# EAGLE design Power Switching Circuit rev3 (EAGLE 9.6.2)

## Sheet 1 of 2
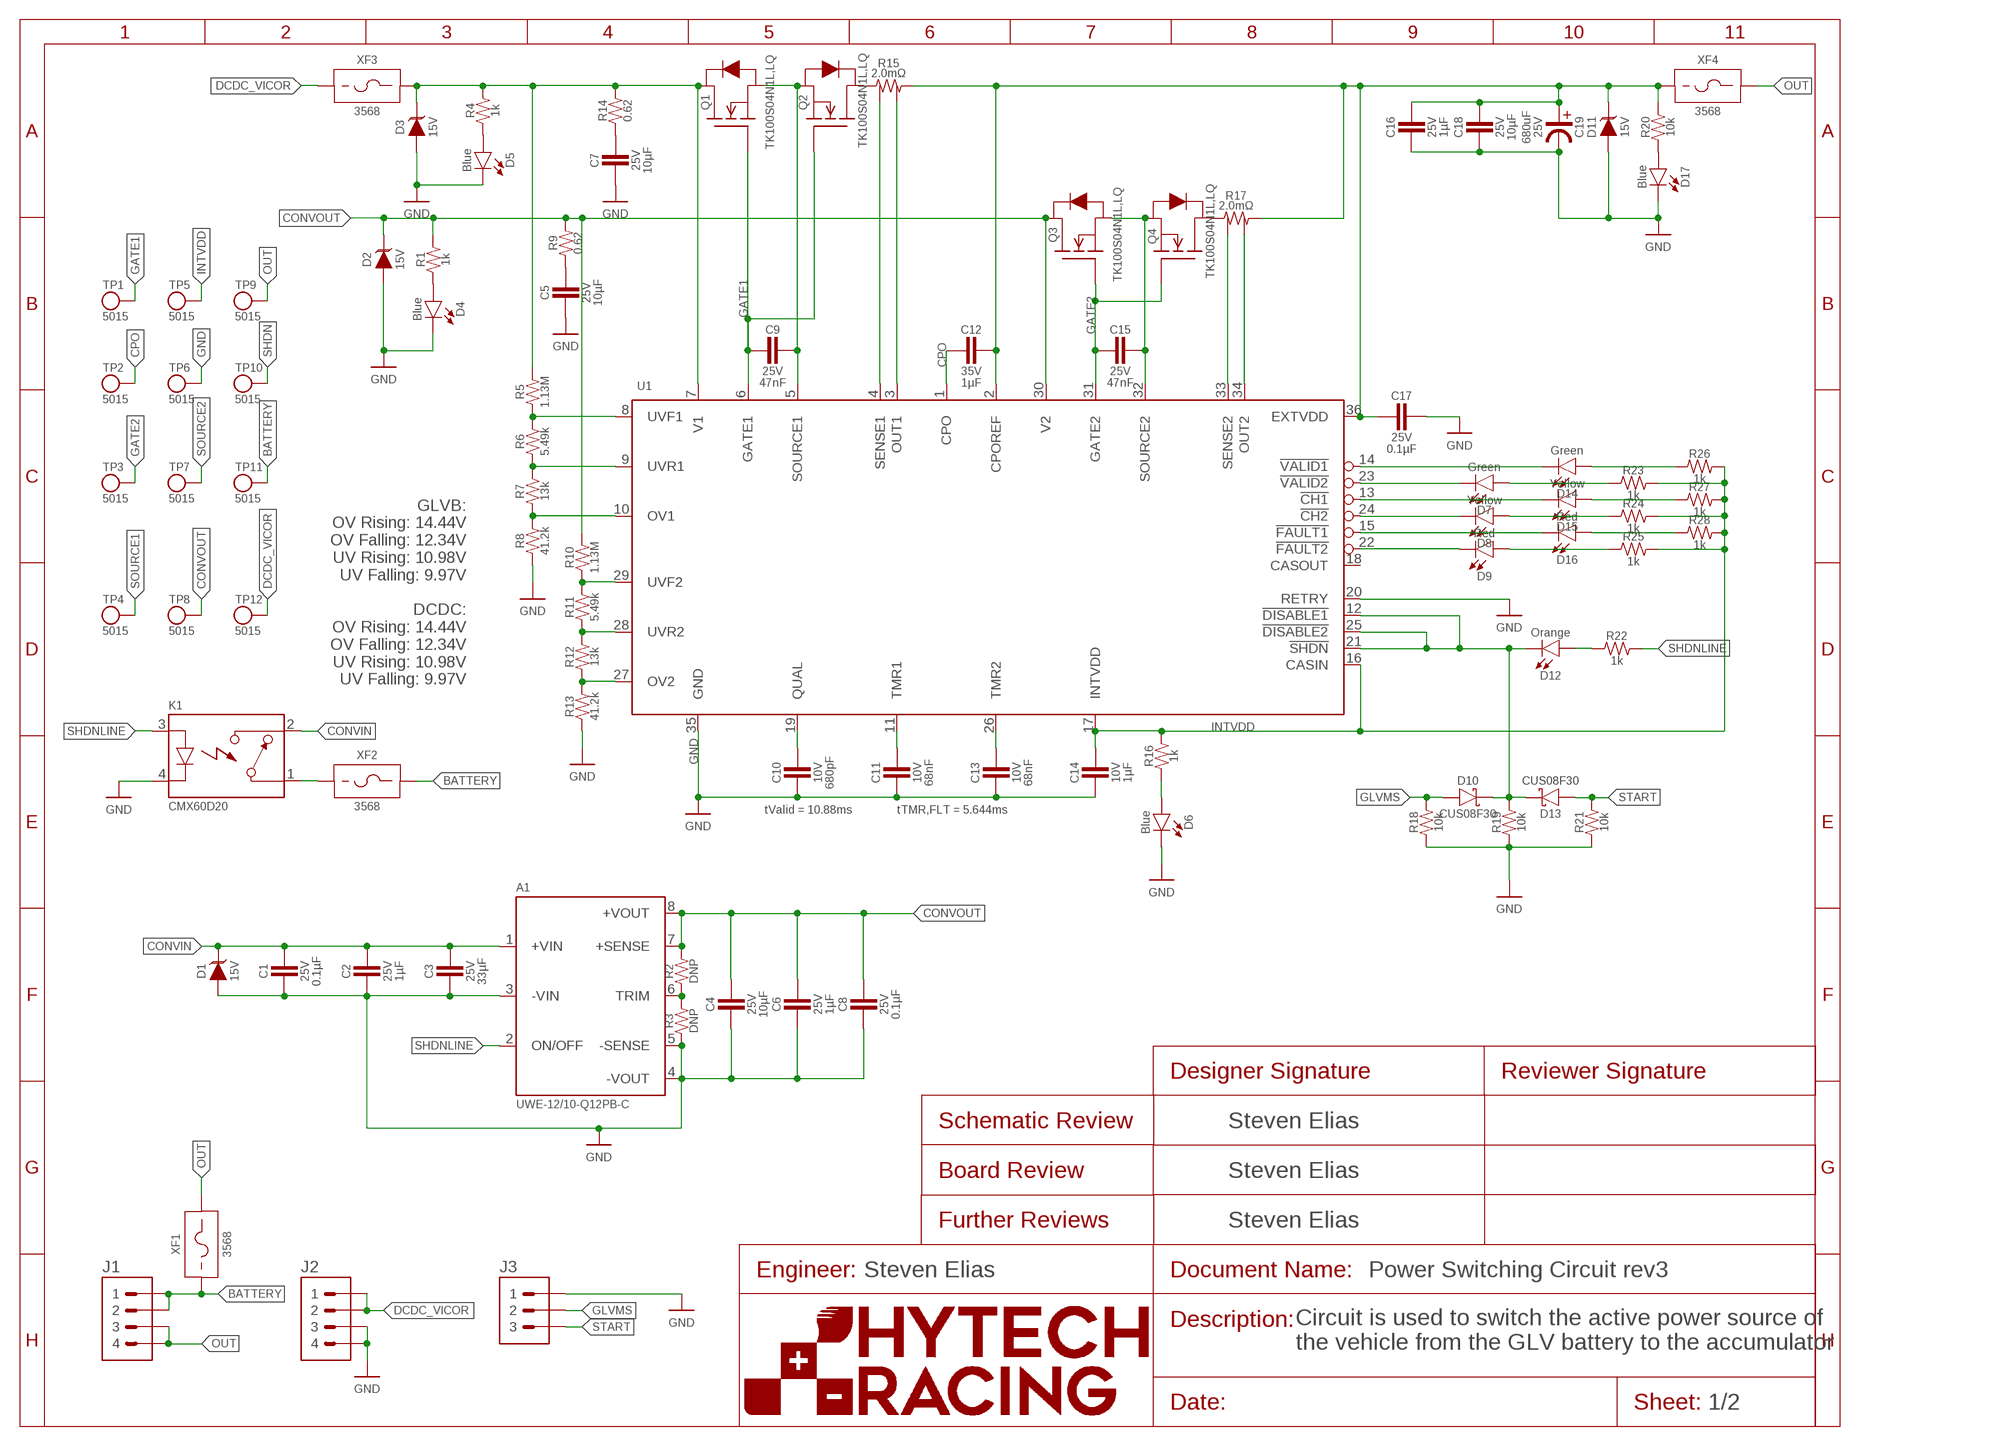
[diagram p0: schematic, sheet 1]

### Parts
A1  UWE-12/10-Q12PB-C  [UWE-*]
C1  CAPACITOR_0603_25V_0.1UF  [0603-CAP]
C2  CAPACITOR_0603_25V_1UF  [0603-CAP]
C3  CAPACITOR_1206_25V_33UF  [1206-CAP]
C4  CAPACITOR_0603_25V_10UF  [0603-CAP]
C5  CAPACITOR_0603_25V_10UF  [0603-CAP]
C6  CAPACITOR_0603_25V_1UF  [0603-CAP]
C7  CAPACITOR_0603_25V_10UF  [0603-CAP]
C8  CAPACITOR_0603_25V_0.1UF  [0603-CAP]
C9  CAPACITOR_0603_25V_47NF  [0603-CAP]
C10  CAPACITOR_0603_10V_680PF  [0603-CAP]
C11  CAPACITOR_0603_10V_68NF  [0603-CAP]
C12  CAPACITOR_0603_35V_1UF  [0603-CAP]
C13  CAPACITOR_0603_10V_68NF  [0603-CAP]
C14  CAPACITOR_0603_10V_1UF  [0603-CAP]
C15  CAPACITOR_0603_25V_47NF  [0603-CAP]
C16  CAPACITOR_0603_25V_1UF  [0603-CAP]
C17  CAPACITOR_0603_25V_0.1UF  [0603-CAP]
C18  CAPACITOR_0603_25V_10UF  [0603-CAP]
C19  EEUFP1E681  [EEUFP1E*]
D1  TVS_15V  [SOT-23]
D2  TVS_15V  [SOT-23]
D3  TVS_15V  [SOT-23]
D4  LED_0603_BLUE  [0603-LED]
D5  LED_0603_BLUE  [0603-LED]
D6  LED_0603_BLUE  [0603-LED]
D7  LED_0603_GREEN  [0603-LED]
D8  LED_0603_YELLOW  [0603-LED]
D9  LED_0603_RED  [0603-LED]
D10  SCHOTTKY_SOD323_30V  [SOD-323]
D11  TVS_15V  [SOT-23]
D12  LED_0603_ORANGE  [0603-LED]
D13  SCHOTTKY_SOD323_30V  [SOD-323]
D14  LED_0603_GREEN  [0603-LED]
D15  LED_0603_YELLOW  [0603-LED]
D16  LED_0603_RED  [0603-LED]
D17  LED_0603_BLUE  [0603-LED]
J1  CONNECTOR-4_SOURIAU_  [SOURIAU_12-04]
J2  CONNECTOR-4_SOURIAU_  [SOURIAU_12-04]
J3  CONNECTOR-3_  [SOURIAU_04-35]
K1  RELAY_SOLIDSTATE_NO_CMX60D20  [CRYDOM_CMX]
Q1  TRANSISTOR_N_MOS_2-7K1S_TK100S04N1LLQ  [DPAK(2-7K1S)]
Q2  TRANSISTOR_N_MOS_2-7K1S_TK100S04N1LLQ  [DPAK(2-7K1S)]
Q3  TRANSISTOR_N_MOS_2-7K1S_TK100S04N1LLQ  [DPAK(2-7K1S)]
Q4  TRANSISTOR_N_MOS_2-7K1S_TK100S04N1LLQ  [DPAK(2-7K1S)]
R1  RESISTOR_0603_1K  [0603-RES]
R2  RESISTOR_0603_DNP  [0603-RES]
R3  RESISTOR_0603_DNP  [0603-RES]
R4  RESISTOR_0603_1K  [0603-RES]
R5  RESISTOR_0603_1.13M  [0603-RES]
R6  RESISTOR_0603_5.49K  [0603-RES]
R7  RESISTOR_0603_13K  [0603-RES]
R8  RESISTOR_0603_41.2K  [0603-RES]
R9  RESISTOR_0805_0.62  [0805-RES]
R10  RESISTOR_0603_1.13M  [0603-RES]
R11  RESISTOR_0603_5.49K  [0603-RES]
R12  RESISTOR_0603_13K  [0603-RES]
R13  RESISTOR_0603_41.2K  [0603-RES]
R14  RESISTOR_0805_0.62  [0805-RES]
R15  RESISTOR_SENSE__WSL40262L000FEB  [4026]
R16  RESISTOR_0603_1K  [0603-RES]
R17  RESISTOR_SENSE__WSL40262L000FEB  [4026]
R18  RESISTOR_0603_10K  [0603-RES]
R19  RESISTOR_0603_10K  [0603-RES]
R20  RESISTOR_0603_10K  [0603-RES]
R21  RESISTOR_0603_10K  [0603-RES]
R22  RESISTOR_0603_1K  [0603-RES]
R23  RESISTOR_0603_1K  [0603-RES]
R24  RESISTOR_0603_1K  [0603-RES]
R25  RESISTOR_0603_1K  [0603-RES]
R26  RESISTOR_0603_1K  [0603-RES]
R27  RESISTOR_0603_1K  [0603-RES]
R28  RESISTOR_0603_1K  [0603-RES]
TP1  TEST_POINT  [5015]
TP2  TEST_POINT  [5015]
TP3  TEST_POINT  [5015]
TP4  TEST_POINT  [5015]
TP5  TEST_POINT  [5015]
TP6  TEST_POINT  [5015]
TP7  TEST_POINT  [5015]
TP8  TEST_POINT  [5015]
TP9  TEST_POINT  [5015]
TP10  TEST_POINT  [5015]
TP11  TEST_POINT  [5015]
TP12  TEST_POINT  [5015]
U1  LTC4421  [SSOP-36]
XF1  FUSE_HOLDER_MINIBLADEPTH  [3568]
XF2  FUSE_HOLDER_MINIBLADEPTH  [3568]
XF3  FUSE_HOLDER_MINIBLADEPTH  [3568]
XF4  FUSE_HOLDER_MINIBLADEPTH  [3568]

### Nets
!CH1: D15.1(C) U1.13(!CH1)
!CH2: D8.1(C) U1.24(!CH2)
!FAULT1: D16.1(C) U1.15(!FAULT1)
!FAULT2: D9.1(C) U1.22(!FAULT2)
!VALID1: D14.1(C) U1.14(!VALID1)
!VALID2: D7.1(C) U1.23(!VALID2)
BATTERY: J1.1 J1.2 TP11.1 XF1.1 XF1.2 XF2.3 XF2.4
CONVIN: A1.1(+VIN) C1.1 C2.1 C3.1 D1.3(C) K1.2(CONTACT2)
CONVOUT: A1.7(+SENSE) A1.8(+VOUT) C4.1 C6.1 C8.1 D2.3(C) Q3.2(D) R1.2 R2.2 R9.2 R10.2 TP8.1 U1.30(V2)
CPO: C12.2 TP2.1 U1.1(CPO)
DCDC_VICOR: J2.1 J2.2 TP12.1 XF3.1 XF3.2
GATE1: C9.2 Q1.1(G) Q2.1(G) TP1.1 U1.6(GATE1)
GATE2: C15.2 Q3.1(G) Q4.1(G) TP3.1 U1.31(GATE2)
GLVMS: D10.A J3.B R18.2
GND: A1.3(-VIN) A1.4(-VOUT) A1.5(-SENSE) C1.2 C2.2 C3.2 C4.2 C5.2 C6.2 C7.2 C8.2 C10.2 C11.2 C13.2 C14.2 C16.2 C17.1 C18.2 C19.P$2(MINUS) D1.1(A) D2.1(A) D3.1(A) D4.1(C) D5.1(C) D6.1(C) D11.1(A) D17.1(C) J2.3 J2.4 J3.A K1.4(CONTROL-) R3.1 R8.1 R13.1 R18.1 R19.1 R21.1 TP6.1 U1.20(RETRY) U1.35(GND)
INTVDD: C14.1 R16.2 R23.2 R24.2 R25.2 R26.2 R27.2 R28.2 TP5.1 U1.16(CASIN) U1.17(INTVDD)
N$1: C10.1 U1.19(QUAL)
N$2: C11.1 U1.11(TMR1)
N$3: C13.1 U1.26(TMR2)
N$4: C5.1 R9.1
N$5: D17.2(A) R20.1
N$6: D4.2(A) R1.1
N$7: D5.2(A) R4.1
N$9: D6.2(A) R16.1
N$11: D9.2(A) R25.1
N$12: K1.1(CONTACT1) XF2.1 XF2.2
N$13: D16.2(A) R28.1
N$15: D8.2(A) R24.1
N$16: A1.6(TRIM) R2.1 R3.2
N$17: D15.2(A) R27.1
N$18: R17.3 U1.33(SENSE2)
N$19: D7.2(A) R23.1
N$20: R17.4 U1.34(OUT2)
N$21: D14.2(A) R26.1
N$22: C7.1 R14.1
N$23: R15.3 U1.4(SENSE1)
N$24: R6.1 R7.2 U1.9(UVR1)
N$25: R7.1 R8.2 U1.10(OV1)
N$26: R10.1 R11.2 U1.29(UVF2)
N$27: R11.1 R12.2 U1.28(UVR2)
N$28: R12.1 R13.2 U1.27(OV2)
N$29: D12.2(A) R22.1
N$30: Q4.2(D) R17.1
N$31: R15.4 U1.3(OUT1)
N$33: Q2.2(D) R15.1
NET: C12.1 C16.1 C17.2 C18.1 C19.P$1(PLUS) D11.3(C) R15.2 R17.2 R20.2 U1.2(CPOREF) U1.36(EXTVDD) XF4.1 XF4.2
NET2: D3.3(C) Q1.2(D) R4.2 R5.2 R14.2 U1.7(V1) XF3.3 XF3.4
OUT: J1.3 J1.4 TP9.1 XF1.3 XF1.4 XF4.3 XF4.4
SHDN: D10.C D12.1(C) D13.C R19.2 TP10.1 U1.12(!DISABLE1) U1.21(!SHDN) U1.25(!DISABLE2)
SHDNLINE: A1.2(ON/OFF) K1.3(CONTROL+) R22.2
SOURCE1: C9.1 Q1.3(S) Q2.3(S) TP4.1 U1.5(SOURCE1)
SOURCE2: C15.1 Q3.3(S) Q4.3(S) TP7.1 U1.32(SOURCE2)
START: D13.A J3.C R21.2
UVF1: R5.1 R6.2 U1.8(UVF1)
Unconnected: U1.18(CASOUT)

### Notes on the sheet
- GLVB:
  OV Rising: 14.44V
  OV Falling: 12.34V
  UV Rising: 10.98V
  UV Falling: 9.97V
  
  DCDC:
  OV Rising: 14.44V
  OV Falling: 12.34V
  UV Rising: 10.98V
  UV Falling: 9.97V
- tValid = 10.88ms | tTMR,FLT = 5.644ms
- Steven Elias
- Steven Elias
- Steven Elias
- Steven Elias
- Circuit is used to switch the active power source of 
  the vehicle from the GLV battery to the accumulator

## Sheet 2 of 2
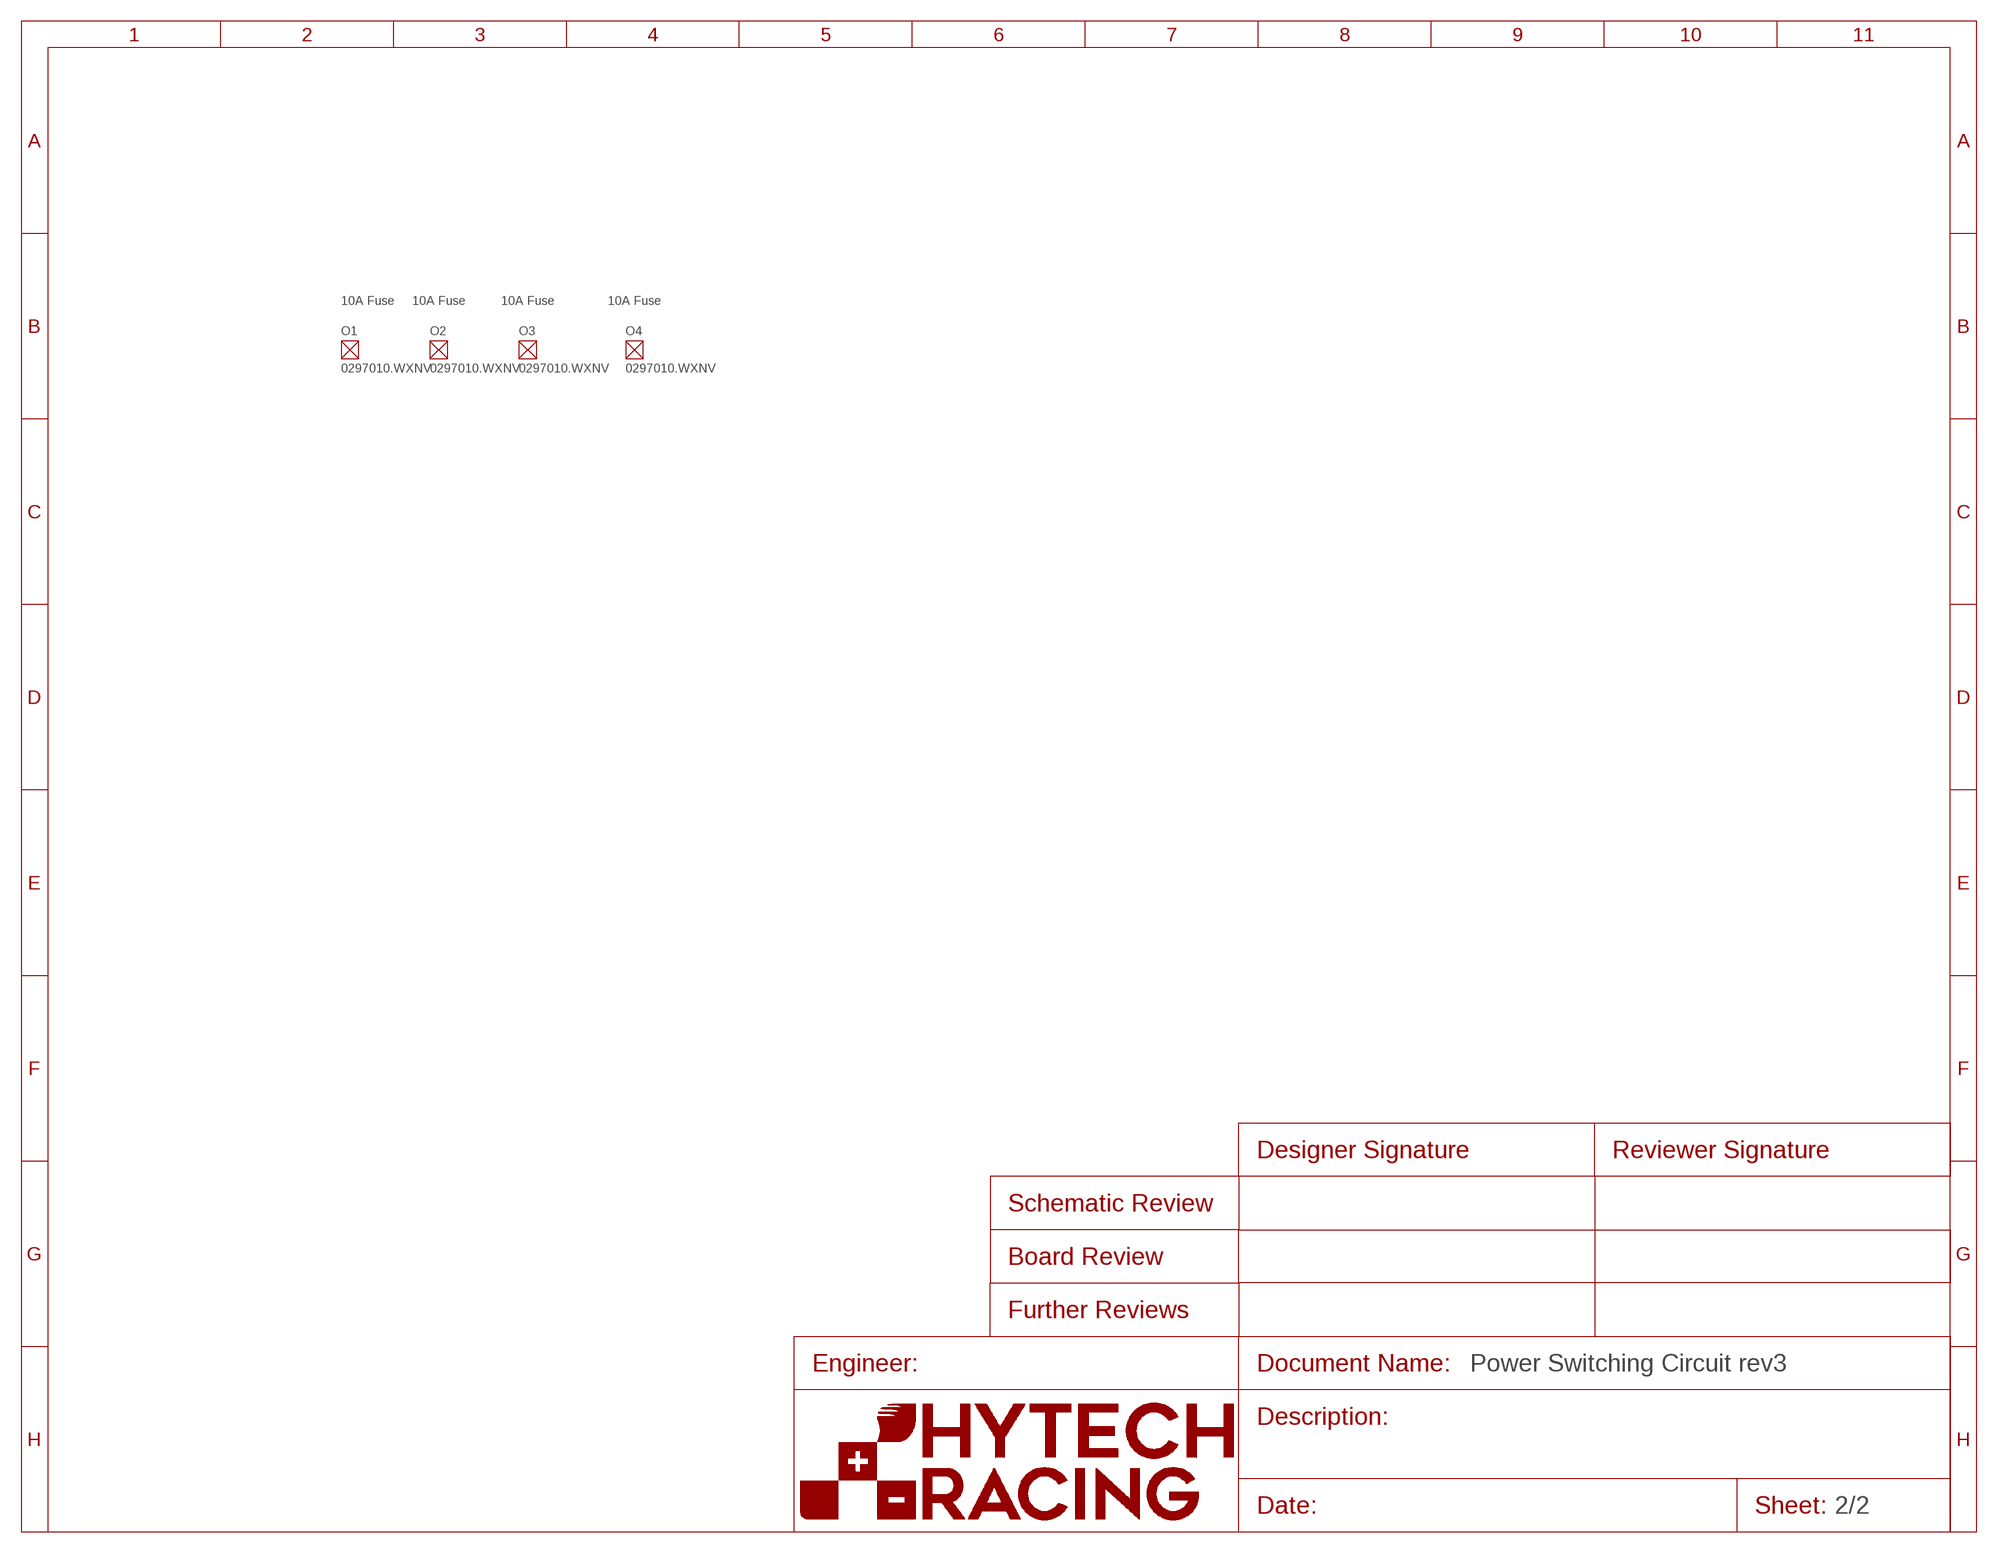
[diagram p1: schematic, sheet 2]
O1 (FUSE_MINI_BLADE_10): DKPN: F991-ND; MANUFACTURER: Littelfuse Inc.; MOPN: 576-0297010.WXNV; MPN: 0297010.WXNV
O2 (FUSE_MINI_BLADE_10): DKPN: F991-ND; MANUFACTURER: Littelfuse Inc.; MOPN: 576-0297010.WXNV; MPN: 0297010.WXNV
O3 (FUSE_MINI_BLADE_10): DKPN: F991-ND; MANUFACTURER: Littelfuse Inc.; MOPN: 576-0297010.WXNV; MPN: 0297010.WXNV
O4 (FUSE_MINI_BLADE_10): DKPN: F991-ND; MANUFACTURER: Littelfuse Inc.; MOPN: 576-0297010.WXNV; MPN: 0297010.WXNV

### Notes on the sheet
- 10A Fuse | 10A Fuse | 10A Fuse | 10A Fuse

## Library data of the parts
A1 = HyTechDevicesTemp:UWE-*: UWE-Q12 Series Wide Input, Isolated Eighth-Brick DCDC Converters Datasheet <https://www.mouser.com/datasheet/2/281/uwe_q12-1919447.pdf>; DKPN: 811-3061-ND; MANUFACTURER: Murata Power Solutions Inc.; MOPN: 580-UWE-12/10Q12PBC; MPN: UWE-12/10-Q12PB-C
C1 C8 C17 = HyTechDevices:CAPACITOR_?_*: Capacitor, Non-Polarized VJ...1BC Series Datasheet <https://www.mouser.com/datasheet/2/427/vjw1bcbascomseries-1762447.pdf> Samsung Datasheet <https://www.mouser.com/datasheet/2/585/MLCC-1837944.pdf> Walsin Datasheet <https://www.mouser.com/datasheet/2/210/WTC_MLCC_General_Purpose-1534899.pdf> GRM188R61A226ME15D <https://www.mouser.com/datasheet/2/281/1/GRM188R61A226ME15_02A-1985787.pdf> GRM188R61E106MA73D <https://www.mouser.com/datasheet/2/281/1/GRM188R61E106MA73_01A-1985806.pdf> 885012006013 <https://www.mouser.com/datasheet/2/445/885012006013-1726946.pdf> 2220Y6300105KXTWS2 <https://www.mouser.com/datasheet/2/218/SMD_High_and_Std_StackiCap_P62-1825512.pdf> Yageo Class 2, X5R <https://www.mouser.com/datasheet/2/447/UPY_GPHC_X5R_4V_to_50V_26-1827097.pdf> TDK C Series <https://www.mouser.com/ProductDetail/TDK/C3216X5R1V226M160AC?qs=%2Fha2pyFadujbcx9jh7lYl%2F4NeMoXFhdc8AqVWNq4wW6M2y7zl6GzBuhgtI0ngznN> AVX Automotive MLCC <https://www.mouser.com/datasheet/2/40/AutoMLCC-777028.pdf> KEMET X7R Series <https://www.mouser.com/datasheet/2/212/KEM_C1002_X7R_SMD-1102033.pdf> Kyocera AVX <https://www.mouser.com/datasheet/2/40/C0GNP0_Dielectric-951274.pdf>; CAPACITANCE: 0.1µF; DKPN: 1276-1006-1-ND; MANUFACTURER: Samsung Electro-Mechanics; MOPN: 187-CL10B104KA8NNNC; MPN: CL10B104KA8NNNC; TOLERANCE: 10%; VOLTAGE: 25V
C2 C6 C16 = HyTechDevices:CAPACITOR_?_*: Capacitor, Non-Polarized VJ...1BC Series Datasheet <https://www.mouser.com/datasheet/2/427/vjw1bcbascomseries-1762447.pdf> Samsung Datasheet <https://www.mouser.com/datasheet/2/585/MLCC-1837944.pdf> Walsin Datasheet <https://www.mouser.com/datasheet/2/210/WTC_MLCC_General_Purpose-1534899.pdf> GRM188R61A226ME15D <https://www.mouser.com/datasheet/2/281/1/GRM188R61A226ME15_02A-1985787.pdf> GRM188R61E106MA73D <https://www.mouser.com/datasheet/2/281/1/GRM188R61E106MA73_01A-1985806.pdf> 885012006013 <https://www.mouser.com/datasheet/2/445/885012006013-1726946.pdf> 2220Y6300105KXTWS2 <https://www.mouser.com/datasheet/2/218/SMD_High_and_Std_StackiCap_P62-1825512.pdf> Yageo Class 2, X5R <https://www.mouser.com/datasheet/2/447/UPY_GPHC_X5R_4V_to_50V_26-1827097.pdf> TDK C Series <https://www.mouser.com/ProductDetail/TDK/C3216X5R1V226M160AC?qs=%2Fha2pyFadujbcx9jh7lYl%2F4NeMoXFhdc8AqVWNq4wW6M2y7zl6GzBuhgtI0ngznN> AVX Automotive MLCC <https://www.mouser.com/datasheet/2/40/AutoMLCC-777028.pdf> KEMET X7R Series <https://www.mouser.com/datasheet/2/212/KEM_C1002_X7R_SMD-1102033.pdf> Kyocera AVX <https://www.mouser.com/datasheet/2/40/C0GNP0_Dielectric-951274.pdf>; CAPACITANCE: 1µF; DKPN: 1276-1184-1-ND; MANUFACTURER: Samsung Electro-Mechanics; MOPN: 187-CL10B105KA8NNNC; MPN: CL10B105KA8NNNC; TOLERANCE: 10%; VOLTAGE: 25V
C3 = HyTechDevices:CAPACITOR_?_*: Capacitor, Non-Polarized VJ...1BC Series Datasheet <https://www.mouser.com/datasheet/2/427/vjw1bcbascomseries-1762447.pdf> Samsung Datasheet <https://www.mouser.com/datasheet/2/585/MLCC-1837944.pdf> Walsin Datasheet <https://www.mouser.com/datasheet/2/210/WTC_MLCC_General_Purpose-1534899.pdf> GRM188R61A226ME15D <https://www.mouser.com/datasheet/2/281/1/GRM188R61A226ME15_02A-1985787.pdf> GRM188R61E106MA73D <https://www.mouser.com/datasheet/2/281/1/GRM188R61E106MA73_01A-1985806.pdf> 885012006013 <https://www.mouser.com/datasheet/2/445/885012006013-1726946.pdf> 2220Y6300105KXTWS2 <https://www.mouser.com/datasheet/2/218/SMD_High_and_Std_StackiCap_P62-1825512.pdf> Yageo Class 2, X5R <https://www.mouser.com/datasheet/2/447/UPY_GPHC_X5R_4V_to_50V_26-1827097.pdf> TDK C Series <https://www.mouser.com/ProductDetail/TDK/C3216X5R1V226M160AC?qs=%2Fha2pyFadujbcx9jh7lYl%2F4NeMoXFhdc8AqVWNq4wW6M2y7zl6GzBuhgtI0ngznN> AVX Automotive MLCC <https://www.mouser.com/datasheet/2/40/AutoMLCC-777028.pdf> KEMET X7R Series <https://www.mouser.com/datasheet/2/212/KEM_C1002_X7R_SMD-1102033.pdf> Kyocera AVX <https://www.mouser.com/datasheet/2/40/C0GNP0_Dielectric-951274.pdf>; CAPACITANCE: 33µF; DKPN: 445-8046-1-ND; MANUFACTURER: TDK Corporation; MOPN: 810-C3216X5R1E336M; MPN: C3216X5R1E336M160AC; TOLERANCE: 20%; VOLTAGE: 25V
C4 C5 C7 C18 = HyTechDevices:CAPACITOR_?_*: Capacitor, Non-Polarized VJ...1BC Series Datasheet <https://www.mouser.com/datasheet/2/427/vjw1bcbascomseries-1762447.pdf> Samsung Datasheet <https://www.mouser.com/datasheet/2/585/MLCC-1837944.pdf> Walsin Datasheet <https://www.mouser.com/datasheet/2/210/WTC_MLCC_General_Purpose-1534899.pdf> GRM188R61A226ME15D <https://www.mouser.com/datasheet/2/281/1/GRM188R61A226ME15_02A-1985787.pdf> GRM188R61E106MA73D <https://www.mouser.com/datasheet/2/281/1/GRM188R61E106MA73_01A-1985806.pdf> 885012006013 <https://www.mouser.com/datasheet/2/445/885012006013-1726946.pdf> 2220Y6300105KXTWS2 <https://www.mouser.com/datasheet/2/218/SMD_High_and_Std_StackiCap_P62-1825512.pdf> Yageo Class 2, X5R <https://www.mouser.com/datasheet/2/447/UPY_GPHC_X5R_4V_to_50V_26-1827097.pdf> TDK C Series <https://www.mouser.com/ProductDetail/TDK/C3216X5R1V226M160AC?qs=%2Fha2pyFadujbcx9jh7lYl%2F4NeMoXFhdc8AqVWNq4wW6M2y7zl6GzBuhgtI0ngznN> AVX Automotive MLCC <https://www.mouser.com/datasheet/2/40/AutoMLCC-777028.pdf> KEMET X7R Series <https://www.mouser.com/datasheet/2/212/KEM_C1002_X7R_SMD-1102033.pdf> Kyocera AVX <https://www.mouser.com/datasheet/2/40/C0GNP0_Dielectric-951274.pdf>; CAPACITANCE: 10µF; DKPN: 490-7202-1-ND; MANUFACTURER: Murata Electronics; MOPN: 81-GRM188R61E106MA3D; MPN: GRM188R61E106MA73D; TOLERANCE: 20%; VOLTAGE: 25V
C9 C15 = HyTechDevices:CAPACITOR_?_*: Capacitor, Non-Polarized VJ...1BC Series Datasheet <https://www.mouser.com/datasheet/2/427/vjw1bcbascomseries-1762447.pdf> Samsung Datasheet <https://www.mouser.com/datasheet/2/585/MLCC-1837944.pdf> Walsin Datasheet <https://www.mouser.com/datasheet/2/210/WTC_MLCC_General_Purpose-1534899.pdf> GRM188R61A226ME15D <https://www.mouser.com/datasheet/2/281/1/GRM188R61A226ME15_02A-1985787.pdf> GRM188R61E106MA73D <https://www.mouser.com/datasheet/2/281/1/GRM188R61E106MA73_01A-1985806.pdf> 885012006013 <https://www.mouser.com/datasheet/2/445/885012006013-1726946.pdf> 2220Y6300105KXTWS2 <https://www.mouser.com/datasheet/2/218/SMD_High_and_Std_StackiCap_P62-1825512.pdf> Yageo Class 2, X5R <https://www.mouser.com/datasheet/2/447/UPY_GPHC_X5R_4V_to_50V_26-1827097.pdf> TDK C Series <https://www.mouser.com/ProductDetail/TDK/C3216X5R1V226M160AC?qs=%2Fha2pyFadujbcx9jh7lYl%2F4NeMoXFhdc8AqVWNq4wW6M2y7zl6GzBuhgtI0ngznN> AVX Automotive MLCC <https://www.mouser.com/datasheet/2/40/AutoMLCC-777028.pdf> KEMET X7R Series <https://www.mouser.com/datasheet/2/212/KEM_C1002_X7R_SMD-1102033.pdf> Kyocera AVX <https://www.mouser.com/datasheet/2/40/C0GNP0_Dielectric-951274.pdf>; CAPACITANCE: 47nF; DKPN: 478-6340-1-ND; MANUFACTURER: Kyocera AVX; MOPN: 581-06033C473K42ZA; MPN: 06033C473K4Z2A; TOLERANCE: 10%; VOLTAGE: 25V
C10 = HyTechDevices:CAPACITOR_?_*: Capacitor, Non-Polarized VJ...1BC Series Datasheet <https://www.mouser.com/datasheet/2/427/vjw1bcbascomseries-1762447.pdf> Samsung Datasheet <https://www.mouser.com/datasheet/2/585/MLCC-1837944.pdf> Walsin Datasheet <https://www.mouser.com/datasheet/2/210/WTC_MLCC_General_Purpose-1534899.pdf> GRM188R61A226ME15D <https://www.mouser.com/datasheet/2/281/1/GRM188R61A226ME15_02A-1985787.pdf> GRM188R61E106MA73D <https://www.mouser.com/datasheet/2/281/1/GRM188R61E106MA73_01A-1985806.pdf> 885012006013 <https://www.mouser.com/datasheet/2/445/885012006013-1726946.pdf> 2220Y6300105KXTWS2 <https://www.mouser.com/datasheet/2/218/SMD_High_and_Std_StackiCap_P62-1825512.pdf> Yageo Class 2, X5R <https://www.mouser.com/datasheet/2/447/UPY_GPHC_X5R_4V_to_50V_26-1827097.pdf> TDK C Series <https://www.mouser.com/ProductDetail/TDK/C3216X5R1V226M160AC?qs=%2Fha2pyFadujbcx9jh7lYl%2F4NeMoXFhdc8AqVWNq4wW6M2y7zl6GzBuhgtI0ngznN> AVX Automotive MLCC <https://www.mouser.com/datasheet/2/40/AutoMLCC-777028.pdf> KEMET X7R Series <https://www.mouser.com/datasheet/2/212/KEM_C1002_X7R_SMD-1102033.pdf> Kyocera AVX <https://www.mouser.com/datasheet/2/40/C0GNP0_Dielectric-951274.pdf>; CAPACITANCE: 680pF; DKPN: 732-7757-1-ND; MANUFACTURER: Würth Elektronik; MOPN: 710-885012006013; MPN: 885012006013; TOLERANCE: 5%; VOLTAGE: 10V
C11 C13 = HyTechDevices:CAPACITOR_?_*: Capacitor, Non-Polarized VJ...1BC Series Datasheet <https://www.mouser.com/datasheet/2/427/vjw1bcbascomseries-1762447.pdf> Samsung Datasheet <https://www.mouser.com/datasheet/2/585/MLCC-1837944.pdf> Walsin Datasheet <https://www.mouser.com/datasheet/2/210/WTC_MLCC_General_Purpose-1534899.pdf> GRM188R61A226ME15D <https://www.mouser.com/datasheet/2/281/1/GRM188R61A226ME15_02A-1985787.pdf> GRM188R61E106MA73D <https://www.mouser.com/datasheet/2/281/1/GRM188R61E106MA73_01A-1985806.pdf> 885012006013 <https://www.mouser.com/datasheet/2/445/885012006013-1726946.pdf> 2220Y6300105KXTWS2 <https://www.mouser.com/datasheet/2/218/SMD_High_and_Std_StackiCap_P62-1825512.pdf> Yageo Class 2, X5R <https://www.mouser.com/datasheet/2/447/UPY_GPHC_X5R_4V_to_50V_26-1827097.pdf> TDK C Series <https://www.mouser.com/ProductDetail/TDK/C3216X5R1V226M160AC?qs=%2Fha2pyFadujbcx9jh7lYl%2F4NeMoXFhdc8AqVWNq4wW6M2y7zl6GzBuhgtI0ngznN> AVX Automotive MLCC <https://www.mouser.com/datasheet/2/40/AutoMLCC-777028.pdf> KEMET X7R Series <https://www.mouser.com/datasheet/2/212/KEM_C1002_X7R_SMD-1102033.pdf> Kyocera AVX <https://www.mouser.com/datasheet/2/40/C0GNP0_Dielectric-951274.pdf>; CAPACITANCE: 68nF; DKPN: 399-C0603C683K8RAC7867CT-ND; MANUFACTURER: KEMET; MOPN: 80-C0603C683K8R; MPN: C0603C683K8RACTU; TOLERANCE: 10%; VOLTAGE: 10V
C12 = HyTechDevices:CAPACITOR_?_*: Capacitor, Non-Polarized VJ...1BC Series Datasheet <https://www.mouser.com/datasheet/2/427/vjw1bcbascomseries-1762447.pdf> Samsung Datasheet <https://www.mouser.com/datasheet/2/585/MLCC-1837944.pdf> Walsin Datasheet <https://www.mouser.com/datasheet/2/210/WTC_MLCC_General_Purpose-1534899.pdf> GRM188R61A226ME15D <https://www.mouser.com/datasheet/2/281/1/GRM188R61A226ME15_02A-1985787.pdf> GRM188R61E106MA73D <https://www.mouser.com/datasheet/2/281/1/GRM188R61E106MA73_01A-1985806.pdf> 885012006013 <https://www.mouser.com/datasheet/2/445/885012006013-1726946.pdf> 2220Y6300105KXTWS2 <https://www.mouser.com/datasheet/2/218/SMD_High_and_Std_StackiCap_P62-1825512.pdf> Yageo Class 2, X5R <https://www.mouser.com/datasheet/2/447/UPY_GPHC_X5R_4V_to_50V_26-1827097.pdf> TDK C Series <https://www.mouser.com/ProductDetail/TDK/C3216X5R1V226M160AC?qs=%2Fha2pyFadujbcx9jh7lYl%2F4NeMoXFhdc8AqVWNq4wW6M2y7zl6GzBuhgtI0ngznN> AVX Automotive MLCC <https://www.mouser.com/datasheet/2/40/AutoMLCC-777028.pdf> KEMET X7R Series <https://www.mouser.com/datasheet/2/212/KEM_C1002_X7R_SMD-1102033.pdf> Kyocera AVX <https://www.mouser.com/datasheet/2/40/C0GNP0_Dielectric-951274.pdf>; CAPACITANCE: 1µF; DKPN: 445-173625-1-ND; MANUFACTURER: TDK Corporation; MOPN: 810-C1608X7R1V105KAE; MPN: C1608X7R1V105K080AE; TOLERANCE: 10%; VOLTAGE: 35V
C14 = HyTechDevices:CAPACITOR_?_*: Capacitor, Non-Polarized VJ...1BC Series Datasheet <https://www.mouser.com/datasheet/2/427/vjw1bcbascomseries-1762447.pdf> Samsung Datasheet <https://www.mouser.com/datasheet/2/585/MLCC-1837944.pdf> Walsin Datasheet <https://www.mouser.com/datasheet/2/210/WTC_MLCC_General_Purpose-1534899.pdf> GRM188R61A226ME15D <https://www.mouser.com/datasheet/2/281/1/GRM188R61A226ME15_02A-1985787.pdf> GRM188R61E106MA73D <https://www.mouser.com/datasheet/2/281/1/GRM188R61E106MA73_01A-1985806.pdf> 885012006013 <https://www.mouser.com/datasheet/2/445/885012006013-1726946.pdf> 2220Y6300105KXTWS2 <https://www.mouser.com/datasheet/2/218/SMD_High_and_Std_StackiCap_P62-1825512.pdf> Yageo Class 2, X5R <https://www.mouser.com/datasheet/2/447/UPY_GPHC_X5R_4V_to_50V_26-1827097.pdf> TDK C Series <https://www.mouser.com/ProductDetail/TDK/C3216X5R1V226M160AC?qs=%2Fha2pyFadujbcx9jh7lYl%2F4NeMoXFhdc8AqVWNq4wW6M2y7zl6GzBuhgtI0ngznN> AVX Automotive MLCC <https://www.mouser.com/datasheet/2/40/AutoMLCC-777028.pdf> KEMET X7R Series <https://www.mouser.com/datasheet/2/212/KEM_C1002_X7R_SMD-1102033.pdf> Kyocera AVX <https://www.mouser.com/datasheet/2/40/C0GNP0_Dielectric-951274.pdf>; CAPACITANCE: 1µF; DKPN: 311-1796-1-ND; MANUFACTURER: Yageo; MOPN: 603-CC603KRX7R6BB105; MPN: CC0603KRX7R6BB105; TOLERANCE: 10%; VOLTAGE: 10V
C19 = HyTechDevicesTemp:EEUFP1E*: EEUFP1E Aluminum Electrolytic Capacitor Datasheet <https://www.mouser.com/datasheet/2/315/RDF0000C1260-1391675.pdf>; CAPACITANCE: 680uF; DKPN: P123947-ND; ESR: 0.068; MANUFACTURER: Panasonic Electronic Components; MOPN: 667-EEU-FP1E681; MPN: EEU-FP1E681; TOLERANCE: 20%; VOLTAGE: 25V
D1-D3 D11 = HyTechDevices:TVS_*: TVS Diode GSOT Datasheet <https://www.mouser.com/datasheet/2/427/gsot03-1767593.pdf>; DKPN: GSOT15-E3-08CT-ND; MANUFACTURER: Vishay General Semiconductor - Diodes Division; MOPN: 78-GSOT15-E3-08; MPN: GSOT15-E3-08; VOLTAGE: 15V
D4-D6 D17 = HyTechDevices:LED_?_*: LED 0603 Blue <https://www.mouser.com/datasheet/2/216/APT1608VBC_D-246010.pdf> Green <https://www.mouser.com/datasheet/2/216/APT1608ZGCK-1173388.pdf> Orange <https://www.mouser.com/datasheet/2/216/APT1608SECK-6197.pdf> Red <https://www.mouser.com/datasheet/2/216/APT1608SECK-J3-PRV-1173336.pdf> White <https://www.mouser.com/datasheet/2/50/SM0603UWC-880813.pdf> Yellow <https://www.mouser.com/datasheet/2/216/APT1608SYCK-J3-PRV-1173311.pdf> 2835 (Series not on Digikey) Lumiled LUXEON 2835 Color Line <https://www.mouser.com/datasheet/2/602/DS236_luxeon_2835_color_line_datasheet-1596094.pdf>; COLOR: Blue; DKPN: 754-1789-1-ND; MANUFACTURER: Kingbright; MOPN: 604-APT1608VBC/D; MPN: APT1608VBC/D
D7 D14 = HyTechDevices:LED_?_*: LED 0603 Blue <https://www.mouser.com/datasheet/2/216/APT1608VBC_D-246010.pdf> Green <https://www.mouser.com/datasheet/2/216/APT1608ZGCK-1173388.pdf> Orange <https://www.mouser.com/datasheet/2/216/APT1608SECK-6197.pdf> Red <https://www.mouser.com/datasheet/2/216/APT1608SECK-J3-PRV-1173336.pdf> White <https://www.mouser.com/datasheet/2/50/SM0603UWC-880813.pdf> Yellow <https://www.mouser.com/datasheet/2/216/APT1608SYCK-J3-PRV-1173311.pdf> 2835 (Series not on Digikey) Lumiled LUXEON 2835 Color Line <https://www.mouser.com/datasheet/2/602/DS236_luxeon_2835_color_line_datasheet-1596094.pdf>; COLOR: Green; DKPN: 754-1790-1-ND; MANUFACTURER: Kingbright; MOPN: 604-APT1608ZGCK; MPN: APT1608ZGCK
D8 D15 = HyTechDevices:LED_?_*: LED 0603 Blue <https://www.mouser.com/datasheet/2/216/APT1608VBC_D-246010.pdf> Green <https://www.mouser.com/datasheet/2/216/APT1608ZGCK-1173388.pdf> Orange <https://www.mouser.com/datasheet/2/216/APT1608SECK-6197.pdf> Red <https://www.mouser.com/datasheet/2/216/APT1608SECK-J3-PRV-1173336.pdf> White <https://www.mouser.com/datasheet/2/50/SM0603UWC-880813.pdf> Yellow <https://www.mouser.com/datasheet/2/216/APT1608SYCK-J3-PRV-1173311.pdf> 2835 (Series not on Digikey) Lumiled LUXEON 2835 Color Line <https://www.mouser.com/datasheet/2/602/DS236_luxeon_2835_color_line_datasheet-1596094.pdf>; COLOR: Yellow; DKPN: 754-1788-1-ND; MANUFACTURER: Kingbright; MOPN: 604-APT1608SYCK/J3-PRV; MPN: APT1608SYCK/J3-PRV
D9 D16 = HyTechDevices:LED_?_*: LED 0603 Blue <https://www.mouser.com/datasheet/2/216/APT1608VBC_D-246010.pdf> Green <https://www.mouser.com/datasheet/2/216/APT1608ZGCK-1173388.pdf> Orange <https://www.mouser.com/datasheet/2/216/APT1608SECK-6197.pdf> Red <https://www.mouser.com/datasheet/2/216/APT1608SECK-J3-PRV-1173336.pdf> White <https://www.mouser.com/datasheet/2/50/SM0603UWC-880813.pdf> Yellow <https://www.mouser.com/datasheet/2/216/APT1608SYCK-J3-PRV-1173311.pdf> 2835 (Series not on Digikey) Lumiled LUXEON 2835 Color Line <https://www.mouser.com/datasheet/2/602/DS236_luxeon_2835_color_line_datasheet-1596094.pdf>; COLOR: Red; DKPN: 754-1786-1-ND; MANUFACTURER: Kingbright; MOPN: 604-APT1608SECKJ3PRV; MPN: APT1608SECK/J3-PRV
D10 D13 = HyTechDevices:SCHOTTKY_?_*: CUS08F30 Shottky Diode Datasheet <https://www.mouser.com/datasheet/2/408/CUS08F30_datasheet_en_20140414-1916097.pdf>; CURRENT: 0.8A; DKPN: CUS08F30H3FTR-ND; MANUFACTURER: Toshiba Semiconductor and Storage; MOPN: 757-CUS08F30H3F; MPN: CUS08F30; VOLTAGE: 30V
D12 = HyTechDevices:LED_?_*: LED 0603 Blue <https://www.mouser.com/datasheet/2/216/APT1608VBC_D-246010.pdf> Green <https://www.mouser.com/datasheet/2/216/APT1608ZGCK-1173388.pdf> Orange <https://www.mouser.com/datasheet/2/216/APT1608SECK-6197.pdf> Red <https://www.mouser.com/datasheet/2/216/APT1608SECK-J3-PRV-1173336.pdf> White <https://www.mouser.com/datasheet/2/50/SM0603UWC-880813.pdf> Yellow <https://www.mouser.com/datasheet/2/216/APT1608SYCK-J3-PRV-1173311.pdf> 2835 (Series not on Digikey) Lumiled LUXEON 2835 Color Line <https://www.mouser.com/datasheet/2/602/DS236_luxeon_2835_color_line_datasheet-1596094.pdf>; COLOR: Orange; DKPN: 754-1120-1-ND; MANUFACTURER: Kingbright; MOPN: 604-APT1608SECK; MPN: APT1608SECK
J1 J2 = HyTechDevices:CONNECTOR-4_?_*; MANUFACTURER: Souriau; MPN: 8STA21204PN
J3 = HyTechDevices:CONNECTOR-3_?
K1 = HyTechDevicesTemp:RELAY_SOLIDSTATE_NO_?*: Solid State Normally Open Relay Crydom CMX Series <https://www.mouser.com/datasheet/2/657/cmx_series_dc_pcb_mount-1370813.pdf>; DKPN: CC1666-ND; MANUFACTURER: Crydom; MOPN: 558-CMX60D20; MPN: CMX60D20
Q1-Q4 = HyTechDevices:TRANSISTOR_N_MOS_?_*: N-MOSFET PMV15ENEA Datasheet <https://www.mouser.com/datasheet/2/916/PMV15ENEA-1604828.pdf> TK6P65W Datasheet <https://www.mouser.com/datasheet/2/408/TK6P65W_datasheet_en_20151225-1916290.pdf> SIR638ADP Datasheet <https://www.mouser.com/datasheet/2/427/sir638adp-1766131.pdf>; DKPN: TK100S04N1LLQCT-ND; MANUFACTURER: Toshiba Semiconductor and Storage; MOPN: 757-TK100S04N1LLQ; MPN: TK100S04N1L,LQ
R1 R4 R16 R22-R28 = HyTechDevices:RESISTOR_?_*: Resistor PWR163 Series <https://www.mouser.com/datasheet/2/54/pwr163-777985.pdf> AC Series <https://www.mouser.com/datasheet/2/447/Yageo_PYu_AC_51_RoHS_L_7_1714230-1874691.pdf> PU Series <https://www.mouser.com/datasheet/2/447/PYu-PU_51_RoHS_L_6-1504619.pdf> ERA Series <https://www.mouser.com/datasheet/2/315/AOA0000C307-1149632.pdf> PWR263 Series <https://www.mouser.com/datasheet/2/54/pwr263s_35-778069.pdf> RC Series <https://www.mouser.com/datasheet/2/447/Yageo_03_18_2021_PYu_RC_Group_51_RoHS_L_11-2199992.pdf> ERJ PB3, PB6 Series <https://www.mouser.com/datasheet/2/315/AOA0000C328-1530132.pdf> ERJ PA2, P03, PA3, P06, P08, P14 Series <https://www.mouser.com/datasheet/2/315/AOA0000C331-1141874.pdf> TE Connectivity/Holsworthy RN73 Series <https://www.mouser.com/datasheet/2/418/4/NG_DS_1773270_M-604713.pdf> Vishay Dale D/CRCW e3 <https://www.mouser.com/datasheet/2/427/dcrcwe3-1762152.pdf>; DKPN: 311-1.00KHRCT-ND; MANUFACTURER: Yageo; MOPN: 603-RC0603FR-071KL; MPN: RC0603FR-071KL; POWER: 0.1W; RESISTANCE: 1k; TOLERANCE: 1%; VOLTAGE_CONTINUOUS: 10.00V; VOLTAGE_MAX: 75V
R2 R3 = HyTechDevices:RESISTOR_?_*: Resistor PWR163 Series <https://www.mouser.com/datasheet/2/54/pwr163-777985.pdf> AC Series <https://www.mouser.com/datasheet/2/447/Yageo_PYu_AC_51_RoHS_L_7_1714230-1874691.pdf> PU Series <https://www.mouser.com/datasheet/2/447/PYu-PU_51_RoHS_L_6-1504619.pdf> ERA Series <https://www.mouser.com/datasheet/2/315/AOA0000C307-1149632.pdf> PWR263 Series <https://www.mouser.com/datasheet/2/54/pwr263s_35-778069.pdf> RC Series <https://www.mouser.com/datasheet/2/447/Yageo_03_18_2021_PYu_RC_Group_51_RoHS_L_11-2199992.pdf> ERJ PB3, PB6 Series <https://www.mouser.com/datasheet/2/315/AOA0000C328-1530132.pdf> ERJ PA2, P03, PA3, P06, P08, P14 Series <https://www.mouser.com/datasheet/2/315/AOA0000C331-1141874.pdf> TE Connectivity/Holsworthy RN73 Series <https://www.mouser.com/datasheet/2/418/4/NG_DS_1773270_M-604713.pdf> Vishay Dale D/CRCW e3 <https://www.mouser.com/datasheet/2/427/dcrcwe3-1762152.pdf>; RESISTANCE: DNP
R5 R10 = HyTechDevices:RESISTOR_?_*: Resistor PWR163 Series <https://www.mouser.com/datasheet/2/54/pwr163-777985.pdf> AC Series <https://www.mouser.com/datasheet/2/447/Yageo_PYu_AC_51_RoHS_L_7_1714230-1874691.pdf> PU Series <https://www.mouser.com/datasheet/2/447/PYu-PU_51_RoHS_L_6-1504619.pdf> ERA Series <https://www.mouser.com/datasheet/2/315/AOA0000C307-1149632.pdf> PWR263 Series <https://www.mouser.com/datasheet/2/54/pwr263s_35-778069.pdf> RC Series <https://www.mouser.com/datasheet/2/447/Yageo_03_18_2021_PYu_RC_Group_51_RoHS_L_11-2199992.pdf> ERJ PB3, PB6 Series <https://www.mouser.com/datasheet/2/315/AOA0000C328-1530132.pdf> ERJ PA2, P03, PA3, P06, P08, P14 Series <https://www.mouser.com/datasheet/2/315/AOA0000C331-1141874.pdf> TE Connectivity/Holsworthy RN73 Series <https://www.mouser.com/datasheet/2/418/4/NG_DS_1773270_M-604713.pdf> Vishay Dale D/CRCW e3 <https://www.mouser.com/datasheet/2/427/dcrcwe3-1762152.pdf>; DKPN: 541-1.13MHCT-ND; MANUFACTURER: Vishay Dale; MOPN: 71-CRCW06031M13FKEA; MPN: CRCW06031M13FKEA; POWER: 0.1W; RESISTANCE: 1.13M; TOLERANCE: 1%; VOLTAGE_CONTINUOUS: 75V; VOLTAGE_MAX: 100V
R6 R11 = HyTechDevices:RESISTOR_?_*: Resistor PWR163 Series <https://www.mouser.com/datasheet/2/54/pwr163-777985.pdf> AC Series <https://www.mouser.com/datasheet/2/447/Yageo_PYu_AC_51_RoHS_L_7_1714230-1874691.pdf> PU Series <https://www.mouser.com/datasheet/2/447/PYu-PU_51_RoHS_L_6-1504619.pdf> ERA Series <https://www.mouser.com/datasheet/2/315/AOA0000C307-1149632.pdf> PWR263 Series <https://www.mouser.com/datasheet/2/54/pwr263s_35-778069.pdf> RC Series <https://www.mouser.com/datasheet/2/447/Yageo_03_18_2021_PYu_RC_Group_51_RoHS_L_11-2199992.pdf> ERJ PB3, PB6 Series <https://www.mouser.com/datasheet/2/315/AOA0000C328-1530132.pdf> ERJ PA2, P03, PA3, P06, P08, P14 Series <https://www.mouser.com/datasheet/2/315/AOA0000C331-1141874.pdf> TE Connectivity/Holsworthy RN73 Series <https://www.mouser.com/datasheet/2/418/4/NG_DS_1773270_M-604713.pdf> Vishay Dale D/CRCW e3 <https://www.mouser.com/datasheet/2/427/dcrcwe3-1762152.pdf>; DKPN: P20367CT-ND; MANUFACTURER: Panasonic Electronic Components; MOPN: 667-ERJ-PB3D5491V; MPN: ERJ-PB3D5491V; POWER: 0.2W; RESISTANCE: 5.49k; TOLERANCE: 0.5%; VOLTAGE_CONTINUOUS: 150V; VOLTAGE_MAX: 200V
R7 R12 = HyTechDevices:RESISTOR_?_*: Resistor PWR163 Series <https://www.mouser.com/datasheet/2/54/pwr163-777985.pdf> AC Series <https://www.mouser.com/datasheet/2/447/Yageo_PYu_AC_51_RoHS_L_7_1714230-1874691.pdf> PU Series <https://www.mouser.com/datasheet/2/447/PYu-PU_51_RoHS_L_6-1504619.pdf> ERA Series <https://www.mouser.com/datasheet/2/315/AOA0000C307-1149632.pdf> PWR263 Series <https://www.mouser.com/datasheet/2/54/pwr263s_35-778069.pdf> RC Series <https://www.mouser.com/datasheet/2/447/Yageo_03_18_2021_PYu_RC_Group_51_RoHS_L_11-2199992.pdf> ERJ PB3, PB6 Series <https://www.mouser.com/datasheet/2/315/AOA0000C328-1530132.pdf> ERJ PA2, P03, PA3, P06, P08, P14 Series <https://www.mouser.com/datasheet/2/315/AOA0000C331-1141874.pdf> TE Connectivity/Holsworthy RN73 Series <https://www.mouser.com/datasheet/2/418/4/NG_DS_1773270_M-604713.pdf> Vishay Dale D/CRCW e3 <https://www.mouser.com/datasheet/2/427/dcrcwe3-1762152.pdf>; DKPN: P13KBECT-ND; MANUFACTURER: Panasonic Electronic Components; MOPN: 667-ERA-3ARW133V; MPN: ERA-3ARW133V; POWER: 0.1W; RESISTANCE: 13k; TOLERANCE: 0.05%; VOLTAGE_CONTINUOUS: 75V; VOLTAGE_MAX: 150V
R8 R13 = HyTechDevices:RESISTOR_?_*: Resistor PWR163 Series <https://www.mouser.com/datasheet/2/54/pwr163-777985.pdf> AC Series <https://www.mouser.com/datasheet/2/447/Yageo_PYu_AC_51_RoHS_L_7_1714230-1874691.pdf> PU Series <https://www.mouser.com/datasheet/2/447/PYu-PU_51_RoHS_L_6-1504619.pdf> ERA Series <https://www.mouser.com/datasheet/2/315/AOA0000C307-1149632.pdf> PWR263 Series <https://www.mouser.com/datasheet/2/54/pwr263s_35-778069.pdf> RC Series <https://www.mouser.com/datasheet/2/447/Yageo_03_18_2021_PYu_RC_Group_51_RoHS_L_11-2199992.pdf> ERJ PB3, PB6 Series <https://www.mouser.com/datasheet/2/315/AOA0000C328-1530132.pdf> ERJ PA2, P03, PA3, P06, P08, P14 Series <https://www.mouser.com/datasheet/2/315/AOA0000C331-1141874.pdf> TE Connectivity/Holsworthy RN73 Series <https://www.mouser.com/datasheet/2/418/4/NG_DS_1773270_M-604713.pdf> Vishay Dale D/CRCW e3 <https://www.mouser.com/datasheet/2/427/dcrcwe3-1762152.pdf>; DKPN: P20155CT-ND; MANUFACTURER: Panasonic Electronic Components; MOPN: 667-ERJ-PB3B4122V; MPN: ERJ-PB3B4122V; POWER: 0.2W; RESISTANCE: 41.2k; TOLERANCE: 0.1%; VOLTAGE_CONTINUOUS: 150V; VOLTAGE_MAX: 200V
R9 R14 = HyTechDevices:RESISTOR_?_*: Resistor PWR163 Series <https://www.mouser.com/datasheet/2/54/pwr163-777985.pdf> AC Series <https://www.mouser.com/datasheet/2/447/Yageo_PYu_AC_51_RoHS_L_7_1714230-1874691.pdf> PU Series <https://www.mouser.com/datasheet/2/447/PYu-PU_51_RoHS_L_6-1504619.pdf> ERA Series <https://www.mouser.com/datasheet/2/315/AOA0000C307-1149632.pdf> PWR263 Series <https://www.mouser.com/datasheet/2/54/pwr263s_35-778069.pdf> RC Series <https://www.mouser.com/datasheet/2/447/Yageo_03_18_2021_PYu_RC_Group_51_RoHS_L_11-2199992.pdf> ERJ PB3, PB6 Series <https://www.mouser.com/datasheet/2/315/AOA0000C328-1530132.pdf> ERJ PA2, P03, PA3, P06, P08, P14 Series <https://www.mouser.com/datasheet/2/315/AOA0000C331-1141874.pdf> TE Connectivity/Holsworthy RN73 Series <https://www.mouser.com/datasheet/2/418/4/NG_DS_1773270_M-604713.pdf> Vishay Dale D/CRCW e3 <https://www.mouser.com/datasheet/2/427/dcrcwe3-1762152.pdf>; DKPN: 311-.62SCT-ND; MANUFACTURER: Yageo; MOPN: 603-RL0805FR-070R62L; MPN: RL0805FR-070R62L; POWER: 0.125W; RESISTANCE: 0.62; TOLERANCE: 1%; VOLTAGE_CONTINUOUS: 0.28V; VOLTAGE_MAX: 0.70V
R15 R17 = HyTechDevicesTemp:RESISTOR_SENSE_?_*: Vishay Dale Current Sense Resistor Datasheet <https://www.mouser.com/datasheet/2/427/VISH_S_A0011243377_1-2572030.pdf>; DKPN: WSLR-.002CT-ND; MANUFACTURER: Vishay Dale; MOPN: 71-WSL40262L000FEB; MPN: WSL40262L000FEB; POWER: 3W; RESISTANCE: 2.0mΩ; TOLERANCE: 1%; VOLTAGE: 0.077V
R18-R21 = HyTechDevices:RESISTOR_?_*: Resistor PWR163 Series <https://www.mouser.com/datasheet/2/54/pwr163-777985.pdf> AC Series <https://www.mouser.com/datasheet/2/447/Yageo_PYu_AC_51_RoHS_L_7_1714230-1874691.pdf> PU Series <https://www.mouser.com/datasheet/2/447/PYu-PU_51_RoHS_L_6-1504619.pdf> ERA Series <https://www.mouser.com/datasheet/2/315/AOA0000C307-1149632.pdf> PWR263 Series <https://www.mouser.com/datasheet/2/54/pwr263s_35-778069.pdf> RC Series <https://www.mouser.com/datasheet/2/447/Yageo_03_18_2021_PYu_RC_Group_51_RoHS_L_11-2199992.pdf> ERJ PB3, PB6 Series <https://www.mouser.com/datasheet/2/315/AOA0000C328-1530132.pdf> ERJ PA2, P03, PA3, P06, P08, P14 Series <https://www.mouser.com/datasheet/2/315/AOA0000C331-1141874.pdf> TE Connectivity/Holsworthy RN73 Series <https://www.mouser.com/datasheet/2/418/4/NG_DS_1773270_M-604713.pdf> Vishay Dale D/CRCW e3 <https://www.mouser.com/datasheet/2/427/dcrcwe3-1762152.pdf>; DKPN: 311-10.0KHRCT-ND; MANUFACTURER: Yageo; MOPN: 603-RC0603FR-0710KL; MPN: RC0603FR-0710KL; POWER: 0.1W; RESISTANCE: 10k; TOLERANCE: 1%; VOLTAGE_CONTINUOUS: 31.62V; VOLTAGE_MAX: 75V
TP1-TP12 = HyTechDevices:TEST_POINT: Test Point for Probing; DKPN: 36-5015CT-ND; MANUFACTURER: Keystone Electronics; MOPN: 534-5015; MPN: 5015
U1 = HyTechDevices:LTC4421: LTC4421 Dual Supply Prioritizer Datasheet <https://www.mouser.com/datasheet/2/609/LTC4421-1716308.pdf>; DKPN: 161-LTC4421CG#PBF-ND; MANUFACTURER: Analog Devices Inc.; MOPN: 584-LTC4421CG#PBF; MPN: LTC4421CG#PBF
XF1-XF4 = HyTechDevices:FUSE_HOLDER_*: Fuse Holder All PNs for the holder; if Miniblade Fuses <https://www.littelfuse.com/media?resourcetype=datasheets&itemid=0f5f58cb-559e-494b-8d53-723f30445ae5&filename=littelfuse-mini-datasheet> needed, order separately. Mini-Blade PTH <https://www.mouser.com/datasheet/2/215/3568-742601.pdf> Mini-Blade SMD <https://www.mouser.com/datasheet/2/215/588-744913.pdf>; DKPN: 36-3568-ND; FUSE_TYPE: MINI 297; MANUFACTURER: Keystone; MOPN: 534-3568; MPN: 3568

## Board
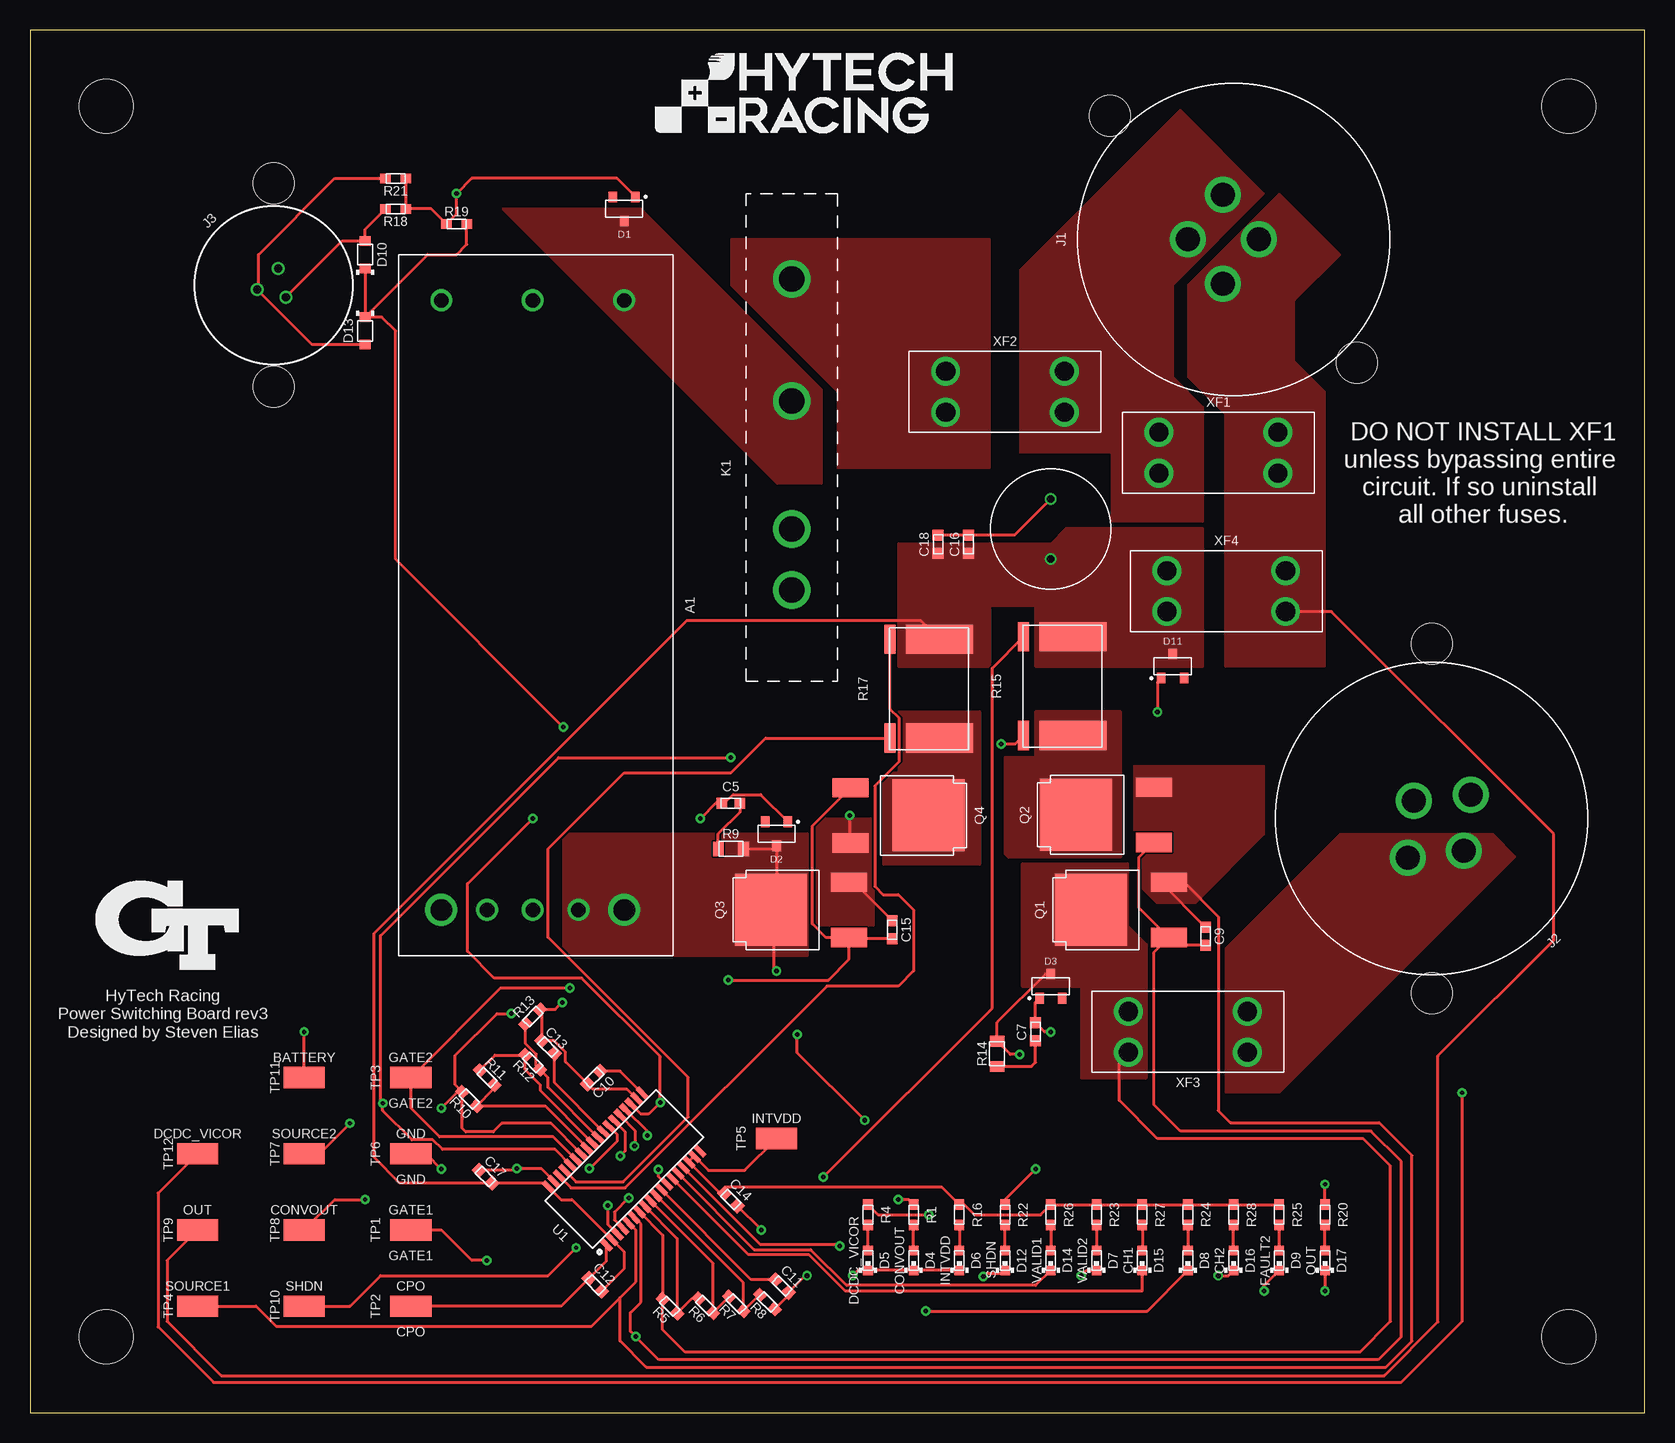
[diagram p2: board, top side]
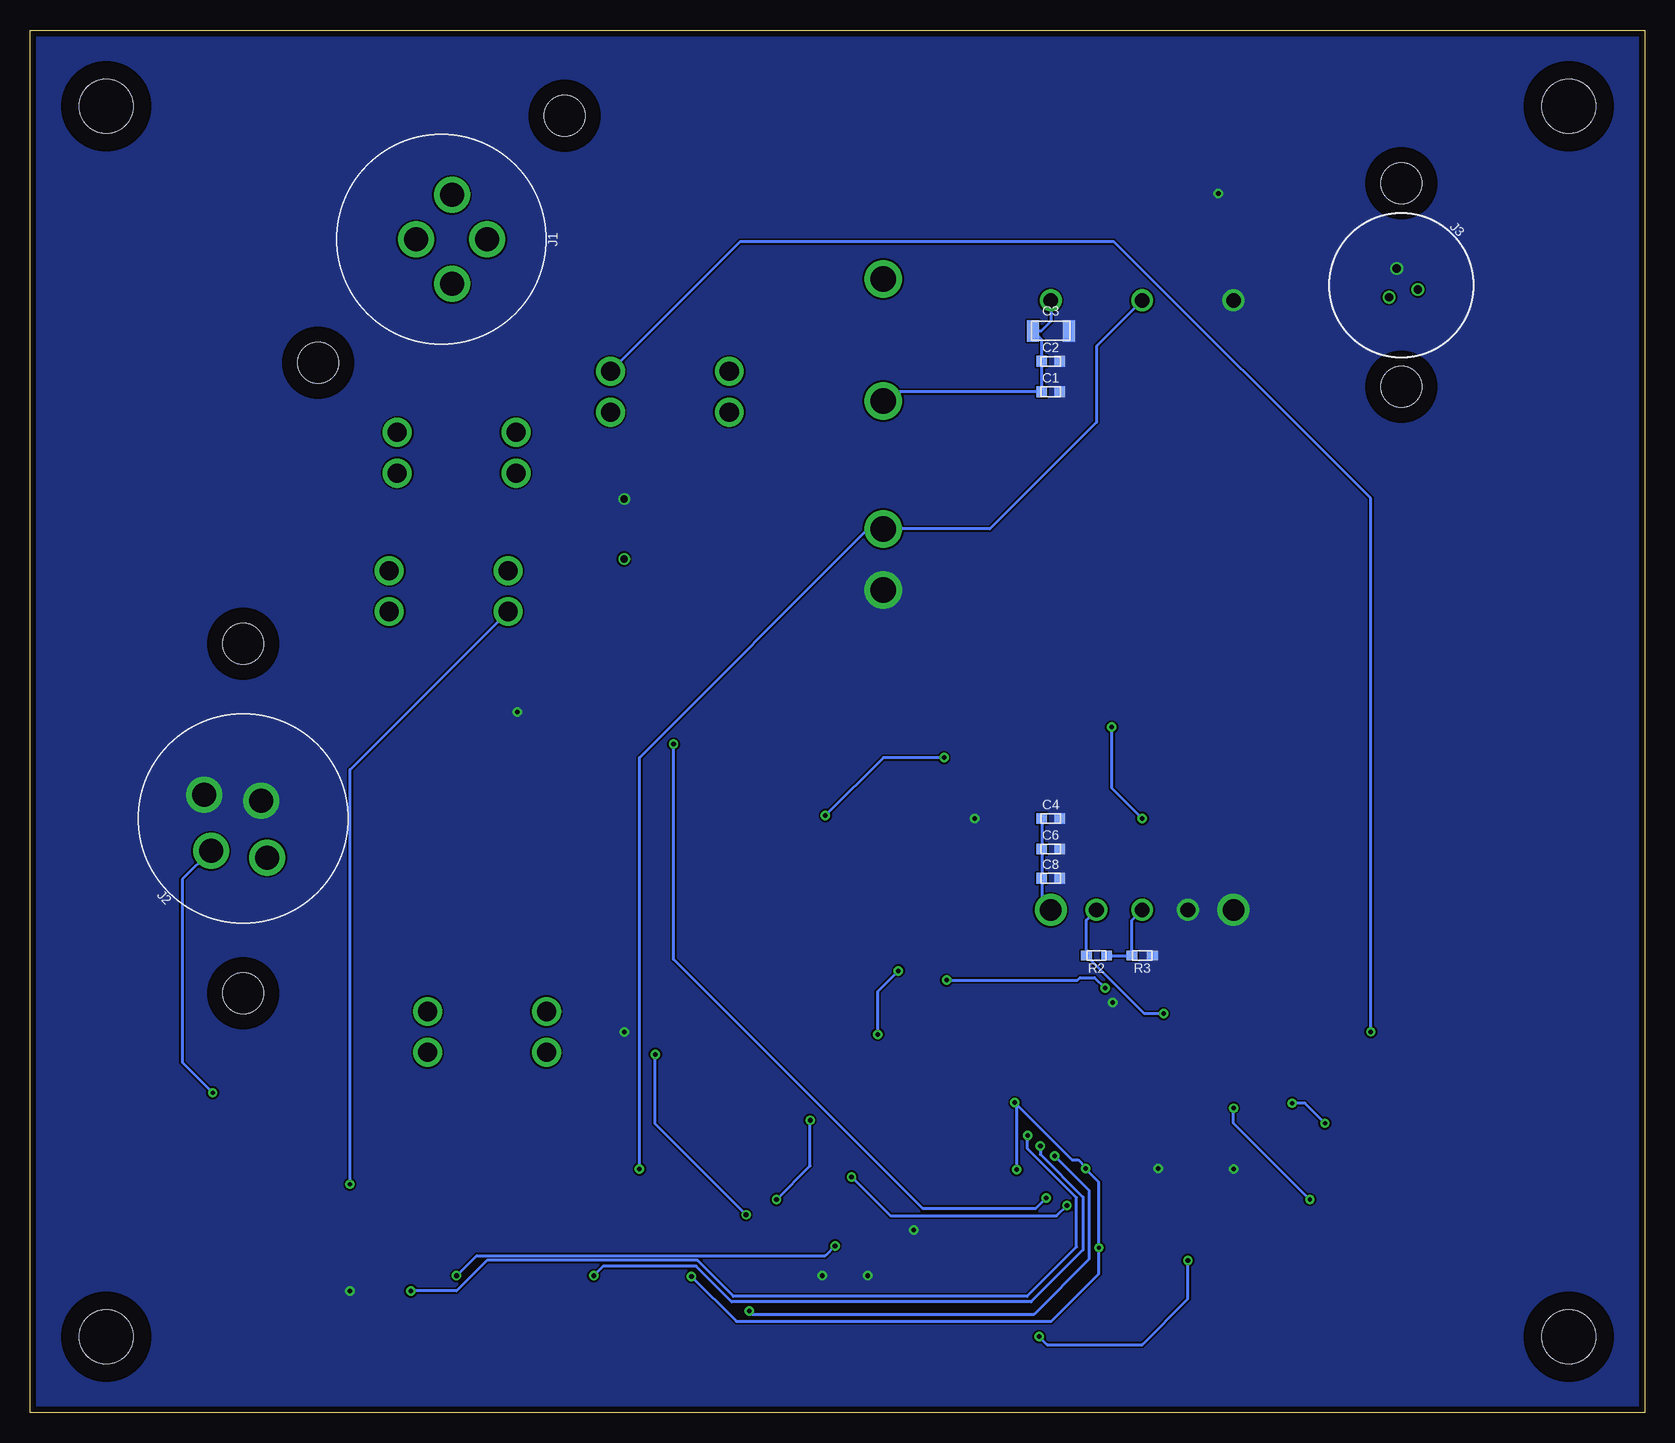
[diagram p3: board, bottom side, seen from below]

Size 134.62 x 115.24 mm. Coordinates in mm from the lower left corner, seen from the top.
Outline: 0,0 134.62,0 134.62,115.24 0,115.24 0,0
Copper layers (1*16): Top 0.035mm / dielectric 1.53mm / Bottom 0.035mm
Design rules "HyTech Default (2 Layer)": minimum track width 6mil, minimum drill 14mil, track to track 6mil, track to pad 6mil, pad to pad 6mil, via to via 20mil, smd to smd 6mil, copper to edge 20mil, drill to drill 21mil, minimum pad ring 7mil, minimum via ring 8mil, stop-mask expansion 6mil, vias tented up to drill 30mil, thermal gap 10mil

### Footprints (pad centres in the part's own frame; a part is rotated, then mirrored left to right if it is on the bottom)
UWE-* = drill 1.219: 1 -25.4,7.62; 2 -25.4,0; 3 -25.4,-7.62; 5 25.4,-3.81; 6 25.4,0; 7 25.4,3.81 | drill 1.778: 4 25.4,-7.62; 8 25.4,7.62
0603-CAP = smd 0.9 x 0.9: 1 -0.75,0; 2 0.75,0
1206-CAP = smd 1 x 1.8: 1 -1.5,0; 2 1.5,0
EEUFP1E* = drill 0.6: P$1 -2.5,0; P$2 2.5,0
SOT-23 = smd 0.711 x 0.889: 1 -0.94,-1.003; 2 0.94,-1.003; 3 0,1.003
0603-LED = smd 0.8 x 0.8: 1 -0.825,0; 2 0.825,0
SOD-323 = smd 0.8 x 0.9: A -1.15,0; C 1.15,0
SOURIAU_12-04 = drill 2: 1 0,3.81; 2 3.708,0.889; 3 0,-2.108; 4 -3.708,0.889 | hole 3.4: 10.288,10.288; -10.288,-10.288
SOURIAU_04-35 = drill 0.7: A 1.24,0.72; B 0,-1.43; C -1.24,0.72 | hole 3.4: 6,6; -6,-6
CRYDOM_CMX = drill 2.108: 1 15.748,0; 2 5.588,0; 3 -5.08,0; 4 -10.16,0
DPAK(2-7K1S) = smd 1.6 x 3: 1 -2.3,-3.5; 3 2.3,-3.5 | smd 6 x 6: 2 0,3
0603-RES = smd 0.9 x 0.8: 1 -0.85,0; 2 0.85,0
0805-RES = smd 0.9 x 1.2: 1 -1.05,0; 2 1.05,0
4026 = smd 2.438 x 5.588: 1 -4.115,-0.889; 2 4.115,-0.889 | smd 2.438 x 0.889: 3 -4.115,3.239; 4 4.115,3.239
5015 = smd 3.429 x 1.778: 1 0,0
SSOP-36 = smd 0.42 x 1.25: 1 -5.525,-3.375; 2 -4.875,-3.375; 3 -4.225,-3.375; 4 -3.575,-3.375; 5 -2.925,-3.375; 6 -2.275,-3.375; 7 -1.625,-3.375; 8 -0.975,-3.375; 9 -0.325,-3.375; 10 0.325,-3.375; 11 0.975,-3.375; 12 1.625,-3.375; 13 2.275,-3.375; 14 2.925,-3.375; 15 3.575,-3.375; 16 4.225,-3.375; 17 4.875,-3.375; 18 5.525,-3.375; 19 5.525,3.375; 20 4.875,3.375; 21 4.225,3.375; 22 3.575,3.375; 23 2.925,3.375; 24 2.275,3.375; 25 1.625,3.375; 26 0.975,3.375; 27 0.325,3.375; 28 -0.325,3.375; 29 -0.975,3.375; 30 -1.625,3.375; 31 -2.275,3.375; 32 -2.925,3.375; 33 -3.575,3.375; 34 -4.225,3.375; 35 -4.875,3.375; 36 -5.525,3.375
MOUNTING_M4 = hole 4.5: 0,0
3568 = drill 1.6: 1 -4.953,1.702; 2 -4.953,-1.702; 3 4.953,-1.702; 4 4.953,1.702

### Placement (x,y rotation side)
A1  41.91,67.31 270 top
C1  49.53,85.09 0 bottom
C2  49.53,87.63 0 bottom
C3  49.53,90.17 0 bottom
C4  49.53,49.53 0 bottom
C5  58.42,50.8 180 top
C6  49.53,46.99 0 bottom
C7  83.82,31.75 90 top
C8  49.53,44.55 0 bottom
C9  97.99,39.73 270 top
C10  46.99,27.94 225 top
C11  62.69,10.57 315 top
C12  47.12,10.67 135 top
C13  43.18,30.48 135 top
C14  58.42,17.78 315 top
C15  71.88,40.26 270 top
C16  78.23,72.39 90 top
C17  37.97,19.68 315 top
C18  75.69,72.39 90 top
C19  85.09,73.66 90 top
D1  49.53,100.33 180 top
D2  62.23,48.26 180 top
D3  85.09,35.56 0 top
D4  73.66,12.7 90 top
D5  69.85,12.7 90 top
D6  77.47,12.7 90 top
D7  88.9,12.7 90 top
D8  96.52,12.7 90 top
D9  104.14,12.7 90 top
D10  27.94,96.52 270 top
D11  95.25,62.23 0 top
D12  81.28,12.7 90 top
D13  27.94,90.17 90 top
D14  85.09,12.7 90 top
D15  92.71,12.7 90 top
D16  100.33,12.7 90 top
D17  107.95,12.7 90 top
J1  100.33,97.79 90 top
J2  116.84,49.53 225 top
J3  20.32,93.98 45 top
K1  63.5,78.74 90 top
Q1  91.44,41.91 90 top
Q2  90.17,49.83 90 top
Q3  64.77,41.91 90 top
Q4  71.88,49.78 270 top
R1  73.66,16.51 90 top
R2  45.72,38.1 180 bottom
R3  41.91,38.1 180 bottom
R4  69.85,16.51 90 top
R5  53.34,8.89 135 top
R6  56.34,8.94 135 top
R7  58.88,9.09 135 top
R8  61.47,9.25 135 top
R9  58.42,46.99 0 top
R10  36.63,26.16 135 top
R11  38.1,27.94 315 top
R12  41.91,29.21 135 top
R13  41.91,33.02 225 top
R14  80.62,29.92 90 top
R15  86.06,60.55 90 top
R16  77.47,16.51 90 top
R17  74.93,60.35 90 top
R18  30.48,100.33 180 top
R19  35.56,99.06 0 top
R20  107.95,16.51 90 top
R21  30.48,102.87 180 top
R22  81.28,16.51 90 top
R23  88.9,16.51 90 top
R24  96.52,16.51 90 top
R25  104.14,16.51 90 top
R26  85.09,16.51 90 top
R27  92.71,16.51 90 top
R28  100.33,16.51 90 top
TP1  31.75,15.24 0 top
TP2  31.75,8.89 0 top
TP3  31.75,27.94 0 top
TP4  13.97,8.89 0 top
TP5  62.23,22.86 0 top
TP6  31.75,21.59 0 top
TP7  22.86,21.59 0 top
TP8  22.86,15.24 0 top
TP9  13.97,15.24 0 top
TP10  22.86,8.89 0 top
TP11  22.86,27.94 0 top
TP12  13.97,21.59 0 top
U1  49.53,20.32 45 top
U$1  [LOGO_GT_MEDIUM]  11.43,40.64 0 top
U$2  [LOGO_HYTECH_MEDIUM]  52.07,106.68 0 top
U$3  [MOUNTING_M4]  128.27,108.89 0 top
U$4  [MOUNTING_M4]  128.27,6.35 0 top
U$5  [MOUNTING_M4]  6.35,108.89 0 top
U$6  [MOUNTING_M4]  6.35,6.35 0 top
XF1  99.06,80.01 0 top
XF2  81.28,85.09 0 top
XF3  96.52,31.75 180 top
XF4  99.72,68.48 0 top

### Tracks (layer width: path | path; a pad name or v marks a point on that pad's centre or on a via)
!CH1
  Top 0.254: U1.13 59.86,13.21 64.9,13.21 67.94,10.16 92.71,10.16 D15.1
!CH2  (via drill 0.38)
  Top 0.254: U1.24 48.75,24.29 49.62,23.42 49.62,21.83 v49.21,21.42 | v74.68,8.48 93.13,8.48 D8.1
  Bottom 0.254: v49.21,21.42 46.33,18.54 46.33,12.81 50.91,8.23 74.42,8.23 v74.68,8.48
!FAULT1  (via drill 0.38)
  Top 0.254: U1.15 60.88,14.02 67.41,14.02 v67.51,13.92 | v99.06,11.43 99.89,11.43 D16.1
  Bottom 0.254: v67.51,13.92 68.33,13.11 97.38,13.11 v99.06,11.43
!FAULT2  (via drill 0.38)
  Top 0.254: U1.22 49.7,25.23 51.46,23.47 v51.46,23.11 | v102.87,10.16 102.87,10.61 D9.1
  Bottom 0.254: v102.87,10.16 99.06,10.16 96.52,12.7 78.99,12.7 75.99,9.7 51.51,9.7 47.37,13.84 47.37,17.94 51.46,22.03 v51.46,23.11
!VALID1
  Top 0.254: U1.14 60.37,13.61 65.06,13.61 68.06,10.62 83.83,10.62 D14.1
!VALID2  (via drill 0.38)
  Top 0.254: U1.23 49.21,24.75 50.44,23.53 50.44,22.29 v50.39,22.25 | v87.63,11.43 88.08,11.88 D7.1
  Bottom 0.254: v87.63,11.43 86.83,12.23 79.1,12.23 76.12,9.26 51.17,9.26 46.84,13.59 46.84,17.99 50.39,21.54 v50.39,22.25
BATTERY  (via drill 0.36)
  Top 0.254: TP11.1 v22.86,31.75
  Bottom 0.254: v22.86,31.75 22.86,76.2 44.25,97.59 75.44,97.59 XF2.4
  pour Top (no thermals): 95.89,108.58 102.87,101.6 95.25,93.98 95.25,86.36 97.79,83.82 97.79,74.27 90.17,74.27 90.17,80.01 82.55,80.01 82.55,95.25
CONVIN
  Bottom 0.254: A1.1 49.53,90.96 50.32,90.17 C3.1 50.28,89.42 C2.1 C1.1 62.74,85.09 K1.2
  pour Top (no thermals): 39.37,100.33 62.23,77.47 66.04,77.47 66.04,85.24 50.95,100.33
CONVOUT  (via drill 0.36, 0.38)
  Top 0.254: D2.3 62.23,46.99 | 62.23,46.99 62.23,42.37 62,42.14 | Q3.2 62,42.14 | R9.2 62.23,46.99 | R1.2 73.24,17.78 v72.39,17.78 | v69.6,24.38 63.96,30.02 v63.96,31.55 | v62.23,36.83 62,37.06 62,42.14 | R10.2 35.42,27.37 35.42,29.76 38.93,33.27 v40.13,33.27 | U1.30 43.42,24.13 39.32,24.13 38.6,23.42 36.33,23.42 36.02,23.72 36.02,24.47 36.03,24.48 R10.2 | TP8.1 25.4,17.78 v27.94,17.78 | v34.29,25.4 35.65,26.76 R10.2
  Bottom 0.254: C4.1 C6.1 C8.1 50.28,42.66 A1.8 | v72.39,17.78 69.6,20.57 v69.6,24.38 | v62.23,36.83 63.96,35.1 v63.96,31.55 | v27.94,17.78 34.29,24.13 v34.29,25.4 | A1.7 46.57,41.06 R2.2 41.74,33.27 v40.13,33.27
  pour Top (no thermals): 44.45,48.26 44.45,38.1 64.85,38.1 64.85,48.26
CPO
  Top 0.254: U1.1 48.01,12.62 C12.2 44.28,8.89 TP2.1
DCDC_VICOR  (via drill 0.36)
  Top 0.254: TP12.1 10.68,18.3 10.68,7.16 15.31,2.54 114.3,2.54 119.38,7.62 v119.38,26.67
  Bottom 0.254: J2.1 121.92,44.45 121.92,29.21 v119.38,26.67
  pour Top (no thermals): 123.83,46.35 104.14,26.67 99.69,26.67 99.69,38.73 109.22,48.26 121.92,48.26
GATE1  (via drill 0.38)
  Top 0.254: U1.6 50.35,16.32 50.93,15.75 50.93,9.23 50.06,8.36 50.06,6.79 v50.49,6.35 52.4,4.45 112.39,4.45 114.3,6.35 114.3,20.95 111.78,23.47 95.91,23.47 93.66,25.72 93.66,38.33 Q1.1 | TP1.1 34.29,15.24 36.83,12.7 v38.1,12.7 | Q2.1 92.4,46.26 92.4,42.15 Q1.1 | C9.2 95.57,38.98 Q1.1
  Bottom 0.254: v50.49,6.35 49.84,5.69 41.91,5.69 38.1,9.5 v38.1,12.7
GATE2  (via drill 0.38)
  Top 0.254: Q3.1 68.27,37.79 66.55,36.07 v58.22,36.07 | U1.31 43.62,23.01 34.14,23.01 31.75,25.4 TP3.1 39.22,35.41 v45.01,35.41 | Q3.1 66.36,39.61 65.22,40.75 65.22,48.92 Q4.1 | C15.2 68.37,39.51 Q3.1
  Bottom 0.254: v58.22,36.07 47.3,36.07 47.09,36.27 45.87,36.27 v45.01,35.41
GLVMS
  Top 0.254: R18.2 27.94,98.64 D10.A 26.03,97.67 J3.B
GND  (via drill 0.36, 0.38)
  Top 0.254: R21.1 R18.1 33.44,100.33 R19.1 35.56,99.91 v35.56,101.6 36.83,102.87 48.93,102.87 D1.1 | C19.P$2 82.07,73.14 C16.2 C18.2 | U1.35 43.7,19.3 42.62,20.37 v40.59,20.37 40.43,20.21 C17.1 | D3.1 83.82,34.23 C7.2 84.57,31.75 v85.09,31.75 | v64.77,11.43 64.61,11.43 C11.2 63.22,9.79 R8.1 | v60.96,15.24 C14.2 | v55.88,49.53 57.15,50.8 C5.2 57.88,50.8 58.6,51.53 60.9,51.53 D2.1 | U1.20 50.57,26.15 49.75,26.97 46.9,26.97 C10.2 44.63,29.24 44.63,30.07 43.68,31.01 C13.2 42.65,33.48 R13.1 43.78,33.62 v44.37,34.21 | TP6.1 33.02,21.59 v34.29,20.32 | D17.1 v107.95,10.16 | D11.1 93.98,60.9 v93.98,58.42 | D6.1 D4.1 D5.1 69.03,11.88 v68.58,11.43
  pour Bottom (no thermals): 0,115.24 0,0 134.62,0 134.62,115.24
INTVDD
  Top 0.254: TP5.1 59.58,20.21 56.56,20.21 55.39,21.38 U1.17 U1.16 57.51,18.31 C14.1 57.89,18.8 76.03,18.8 R16.2 77.89,17.36 78.74,16.51 84.24,16.51 R26.2 R23.2 R27.2 R24.2 R28.2 R25.2
N$1
  Top 0.254: U1.19 49.19,28.47 C10.1
N$2
  Top 0.254: C11.1 60.12,11.1 U1.11
N$3
  Top 0.254: U1.26 43.71,27.52 C13.1
N$4
  Top 0.254: C5.1 59.17,50.06 57.37,48.26 R9.1
N$5
  Top 0.254: D17.2 R20.1
N$6
  Top 0.254: D4.2 R1.1
N$7
  Top 0.254: D5.2 R4.1
N$9
  Top 0.254: R16.1 D6.2
N$11
  Top 0.254: D9.2 R25.1
N$12
  pour Top (no thermals): 58.42,97.79 58.42,93.98 67.31,85.09 67.31,78.74 80.01,78.74 80.01,97.79
N$13
  Top 0.254: D16.2 R28.1
N$15
  Top 0.254: R24.1 D8.2
N$16
  Bottom 0.254: R2.1 R3.2 42.76,41.06 A1.6
N$17
  Top 0.254: R27.1 D15.2
N$18
  Top 0.254: R17.3 61.32,56.24 58.42,53.34 49.53,53.34 43.18,46.99 43.18,39.63 54.86,27.95 54.86,24.67 49.45,19.26 45.51,19.26 44.62,20.15 U1.33
N$19
  Top 0.254: R23.1 D7.2
N$20
  Top 0.254: U1.34 44.16,19.69 45.1,18.75 49.61,18.75 66.42,35.56 72.39,35.56 73.66,36.83 73.66,41.91 72.39,43.18 71.12,43.18 70.42,43.88 70.42,52.25 72.47,54.29 72.47,57.88 71.69,58.65 R17.4
N$21
  Top 0.254: R26.1 D14.2
N$22
  Top 0.254: R14.1 83.48,28.87 83.82,29.21 C7.1
N$23  (via drill 0.38)
  Top 0.254: R15.3 82.11,55.73 v80.97,55.73 | U1.4 49.39,15.43 48.72,16.09 48.72,16.72 v49.91,17.91
  Bottom 0.254: v49.91,17.91 50.77,17.04 60.22,17.04 80.97,37.8 v80.97,55.73
N$24
  Top 0.254: U1.9 56.94,12.45 R6.1 58.28,9.68 R7.2
N$25
  Top 0.254: U1.10 59.48,10.83 R7.1 60.83,9.85 R8.2
N$26
  Top 0.254: U1.29 46.45,22.07 42.97,25.56 R10.1 38.7,27.03 R11.2
N$27
  Top 0.254: U1.28 42.55,26.84 42.55,27.3 41.27,28.57 41.27,29.78 R12.2 38.77,29.81 R11.1
N$28
  Top 0.254: U1.27 43.18,27.13 43.18,27.94 R12.1 42.19,28.93 42.19,29.89 41.31,30.77 R13.2
N$29
  Top 0.254: D12.2 R22.1
N$30
  pour Top (no thermals): 72.39,58.42 72.39,53.34 71.12,53.34 71.12,45.72 79.25,45.72 79.25,58.42
N$31  (via drill 0.38)
  Top 0.254: U1.3 48.18,15.69 v48.18,17.27 | v66.14,19.66 80.21,33.73 80.21,62.06 R15.4
  Bottom 0.254: v48.18,17.27 49.05,16.41 62.89,16.41 v66.14,19.66
N$33
  pour Top (no thermals): 83.82,58.42 83.82,54.61 81.28,54.61 81.28,46.58 81.53,46.33 90.93,46.33 90.93,58.42
NET  (via drill 0.36)
  Top 0.254: R17.2 74.24,66.04 54.76,66.04 28.7,39.98 28.7,21.29 30.83,19.16 C17.2 42.88,19.16 U1.36 44.26,17.78 45.18,17.78 U1.2 49.53,13.43 49.53,12.02 C12.1 | R20.2 v107.95,19.05
  Bottom 0.254: v107.95,19.05 107.95,53.59 XF4.2
  pour Top (no thermals): 72.39,67.31 72.39,62.23 80.01,62.23 80.01,67.31 83.82,67.31 83.82,62.23 97.79,62.23 97.79,73.66 86.36,73.66 85.09,72.39 72.39,72.39
NET2  (via drill 0.38)
  Top 0.254: U1.7 52.74,14.81 R5.2 52.74,6.93 54.61,5.05 110.85,5.05 113.41,7.62 113.41,20.57 111.12,22.86 93.98,22.86 90.81,26.04 90.81,29.29 XF3.4 | R4.2 70.7,16.51 v74.93,16.51 | v82.5,29.87 81.72,29.87 R14.2 80.62,32.55 84.63,36.56 D3.3
  Bottom 0.254: v74.93,16.51 82.5,24.08 v82.5,29.87
  pour Top (no thermals): 82.7,45.72 82.7,35.56 87.63,35.56 87.63,27.94 93.07,27.94 93.07,39.01 91.54,40.54 91.54,45.72
OUT
  Top 0.254: XF4.3 108.48,66.78 127,48.26 127,39.37 117.37,29.74 117.37,7.58 112.89,3.1 15.95,3.1 11.43,7.62 11.43,12.7 TP9.1
  pour Top (no thermals): 104.14,101.6 96.52,93.98 96.52,86.36 99.62,83.26 99.62,62.23 107.95,62.23 107.95,85.09 105.41,87.63 105.41,92.71 109.22,96.52
SHDN  (via drill 0.36, 0.38)
  Top 0.254: D10.C D13.C | D13.C 33.14,96.52 35.56,96.52 36.41,97.37 R19.2 | v79.48,11.35 79.73,11.61 81.01,11.61 D12.1 | U1.21 50.93,24.89 51.56,24.89 v52.53,25.86 52.53,29.67 52.55,29.69 46,36.23 38.7,36.23 36.47,38.46 36.47,44.09 v41.91,49.53 | U1.12 53.02,19.08 52.37,19.73 v52.37,20.27 | v46.63,20.35 48.96,22.68 48.96,23.19 U1.25 | v44.45,57.15 30.48,71.12 30.48,90.17 29.33,91.32 D13.C | TP10.1 26.67,8.89 29.21,11.43 43.18,11.43 v45.52,13.77
  Bottom 0.254: v79.48,11.35 75.74,7.62 49.49,7.62 45.52,11.59 v45.52,13.77 45.52,19.23 v46.63,20.35 46.63,20.47 47.24,21.08 47.75,21.08 v52.53,25.86 52.37,25.7 v52.37,20.27 | v41.91,49.53 44.45,52.07 v44.45,57.15
SHDNLINE  (via drill 0.38)
  Top 0.254: v83.82,20.32 81.28,17.78 R22.2
  Bottom 0.254: v83.82,20.32 83.82,54.61 64.77,73.66 K1.3 54.61,73.66 45.72,82.55 45.72,88.9 A1.2
SOURCE1
  Top 0.254: U1.5 49.88,15.87 50.51,15.23 50.51,10.93 49.17,9.6 | C9.1 94.26,44.21 Q1.3 96.21,44.21 99.06,41.36 99.06,25.2 100.08,24.18 112.47,24.18 115.19,21.46 115.19,5.97 113.03,3.81 51.36,3.81 49.17,5.99 49.17,9.6 | TP4.1 18.84,8.89 20.52,7.21 46.79,7.21 49.17,9.6
  pour Top (no thermals): 92.05,53.85 92.05,44.4 93.88,42.57 97.18,42.57 102.87,48.26 102.87,53.85
SOURCE2  (via drill 0.36, 0.38)
  Top 0.254: U1.32 43.77,21.95 34.39,21.95 33.58,22.76 31.85,22.76 29.41,25.2 v29.41,25.81 29.21,26.01 29.21,39.78 44.04,54.61 v58.42,54.61 | Q4.3 68.32,47.55 v68.32,49.78 | C15.1 68.68,44.21 Q3.3 | TP7.1 24.13,21.59 v26.67,24.13
  Bottom 0.254: v58.42,54.61 63.49,54.61 v68.32,49.78 | v26.67,24.13 28.35,25.81 v29.41,25.81
  pour Top (no thermals): 65.53,49.53 65.53,40.64 70.36,40.64 70.36,49.53
START
  Top 0.254: D13.A 23.53,89.02 J3.C 19.05,93.73 19.05,96.52 25.4,102.87 R21.2
UVF1
  Top 0.254: U1.8 53.94,14.53 R5.1 55.19,9.54 R6.2

### Text on the board
tPlace: DO NOT INSTALL XF1 / unless bypassing entire / circuit. If so uninstall / all other fuses. | HyTech Racing / Power Switching Board rev3 / Designed by Steven Elias | GATE2 | GND | GATE1 | DCDC_VICOR | CONVOUT | INTVDD | SHDN | VALID1 | VALID2 | CH1 | CH2 | FAULT2 | OUT | CPO